# EAGLE schematic OSD62-PM-BRK (EAGLE 9.6.2)
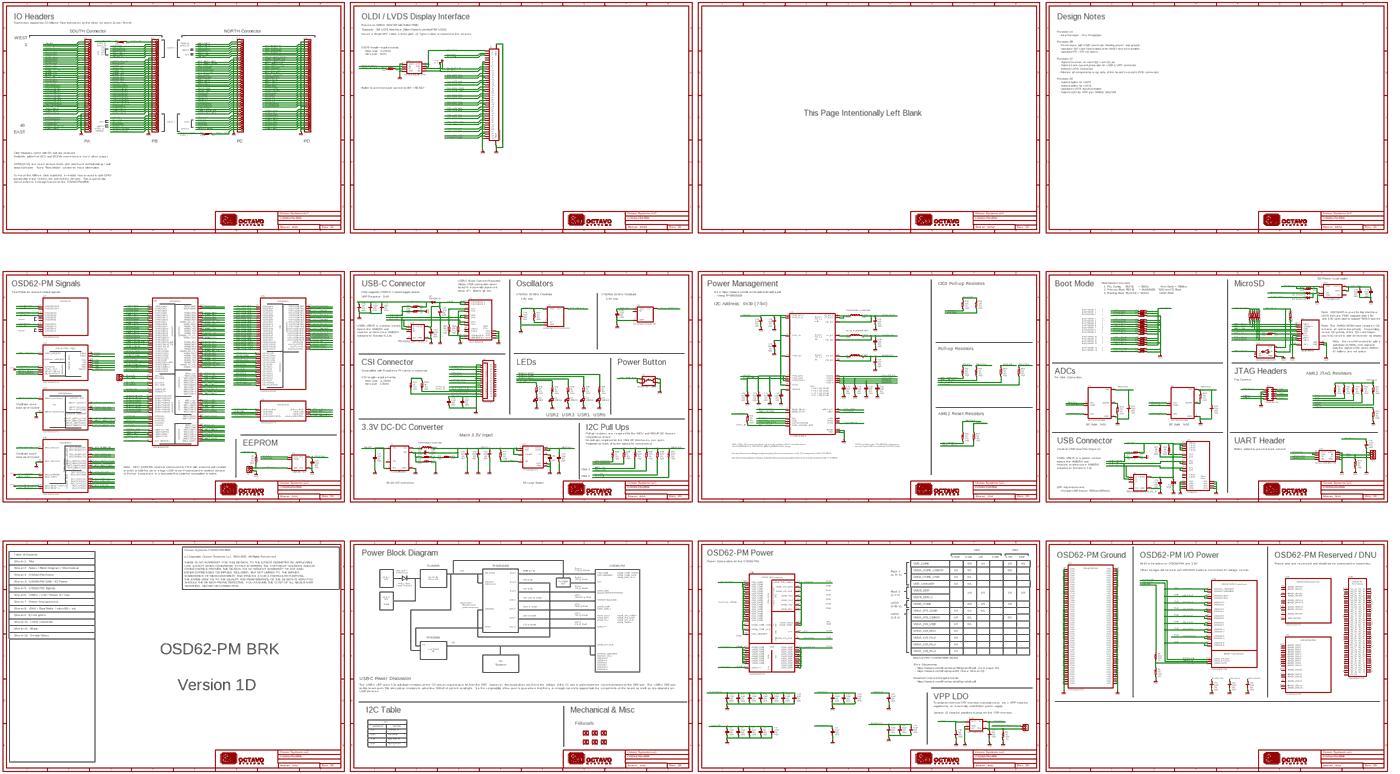
[diagram p0: schematic, sheet 1, overview]
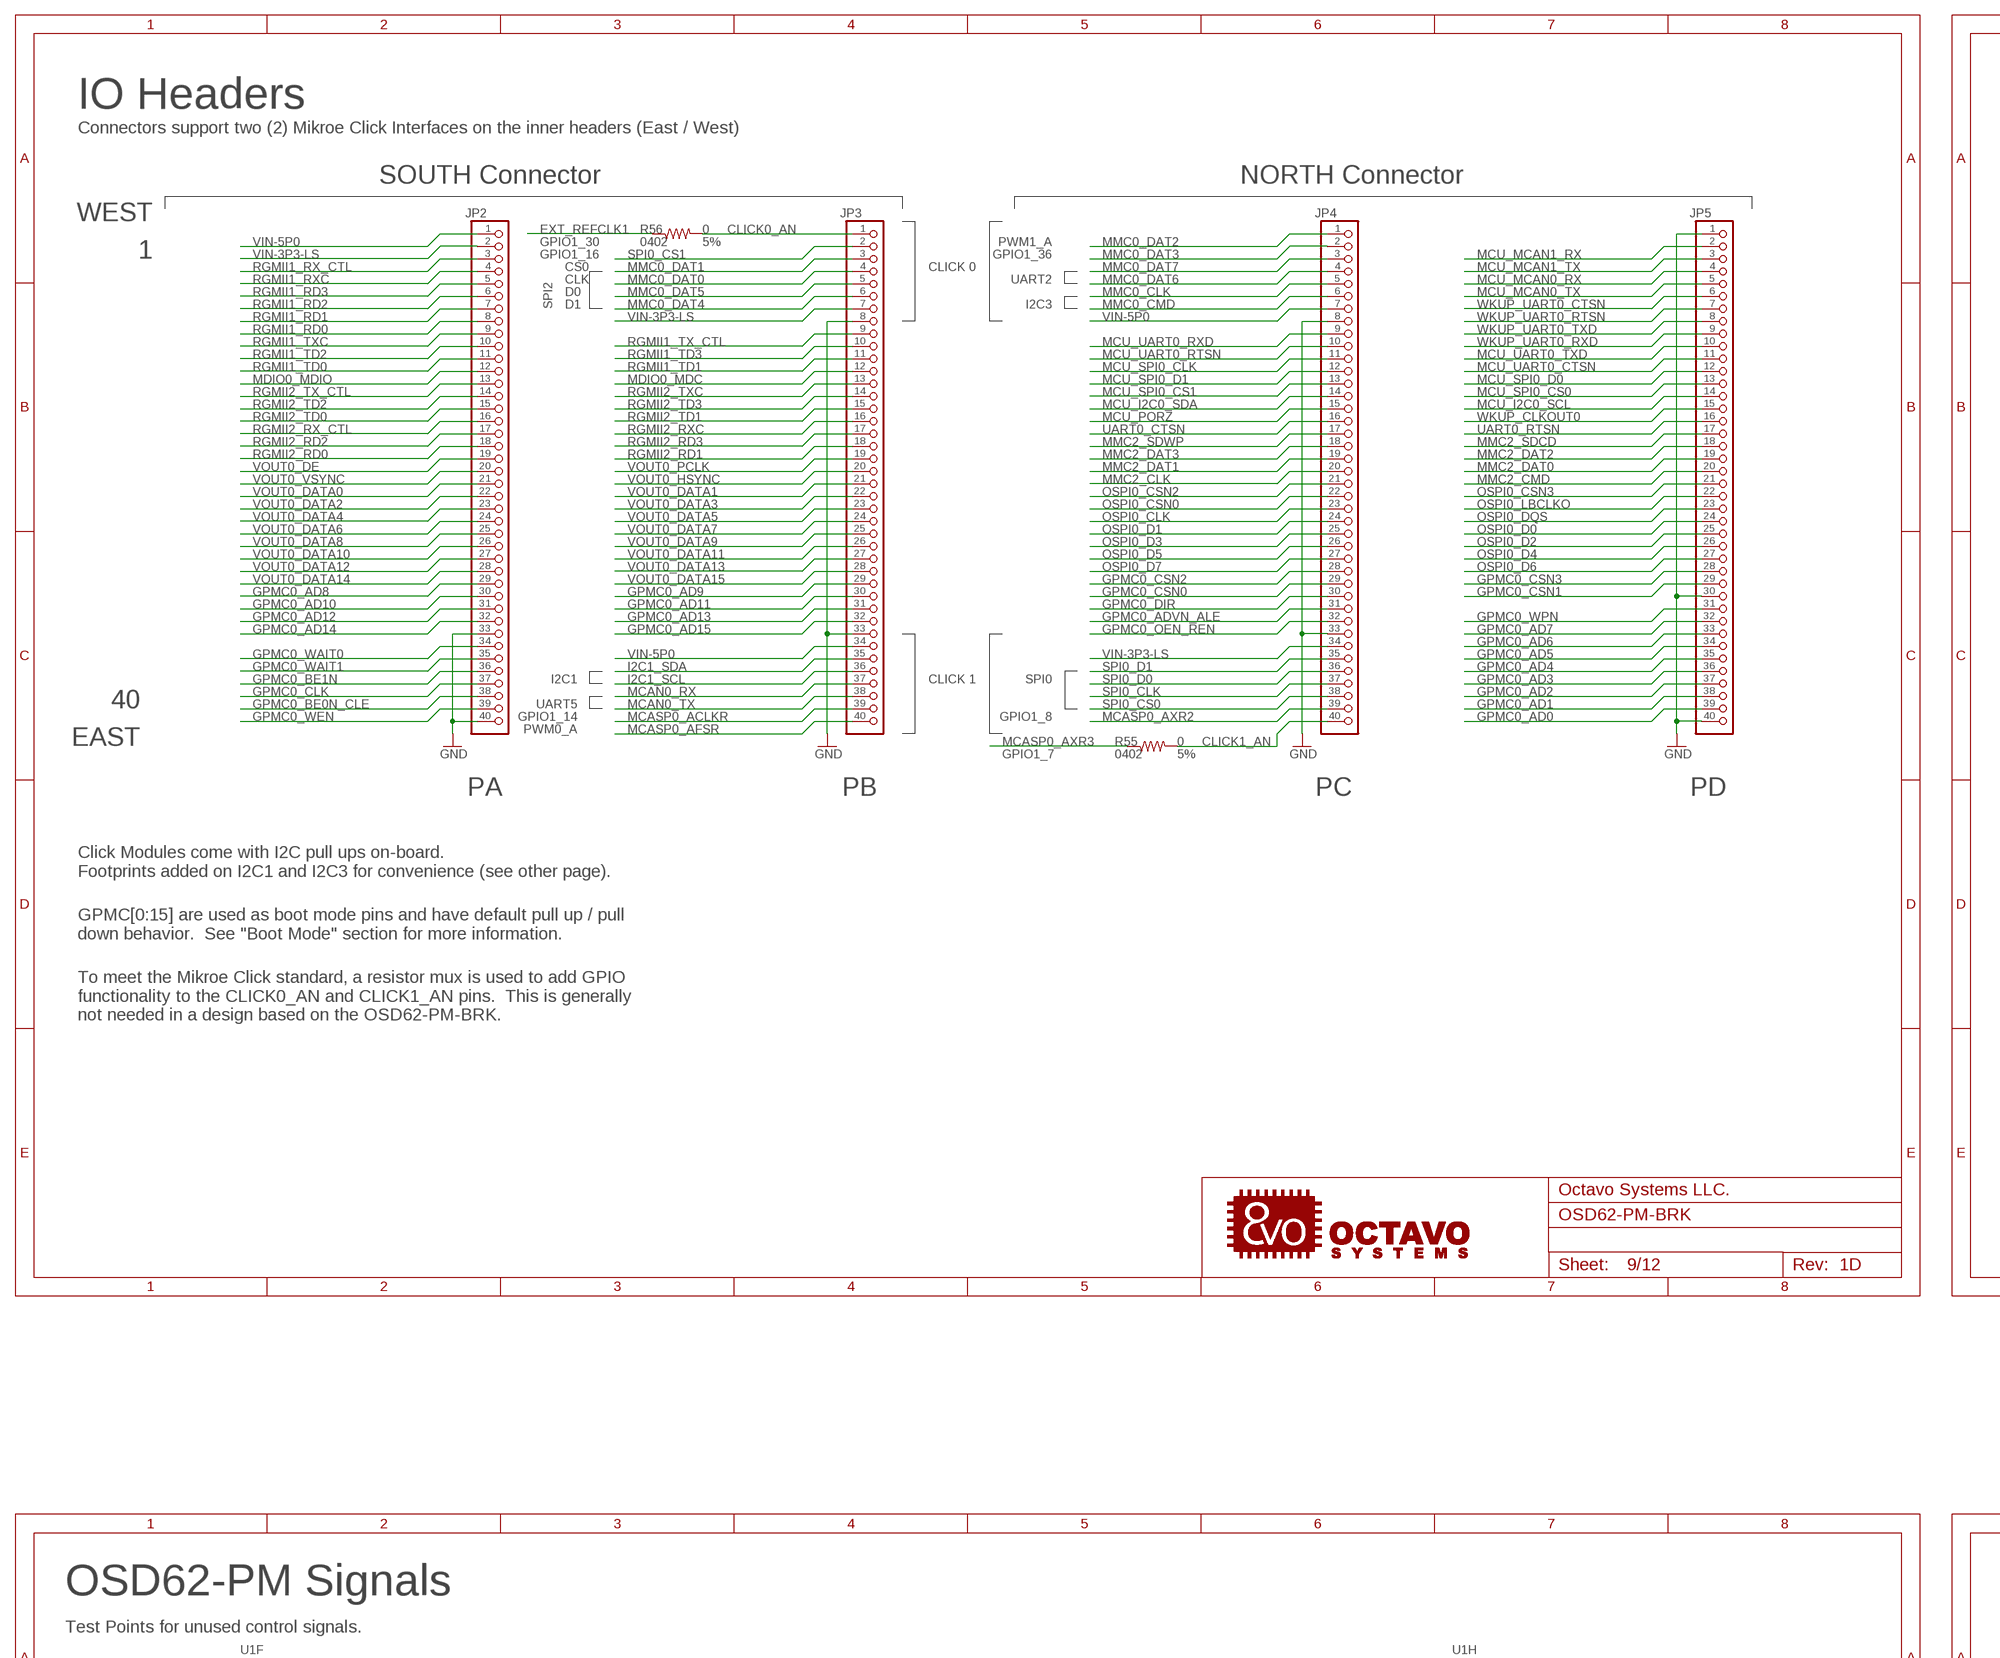
[diagram p1: schematic, sheet 1, part 1 of 8]
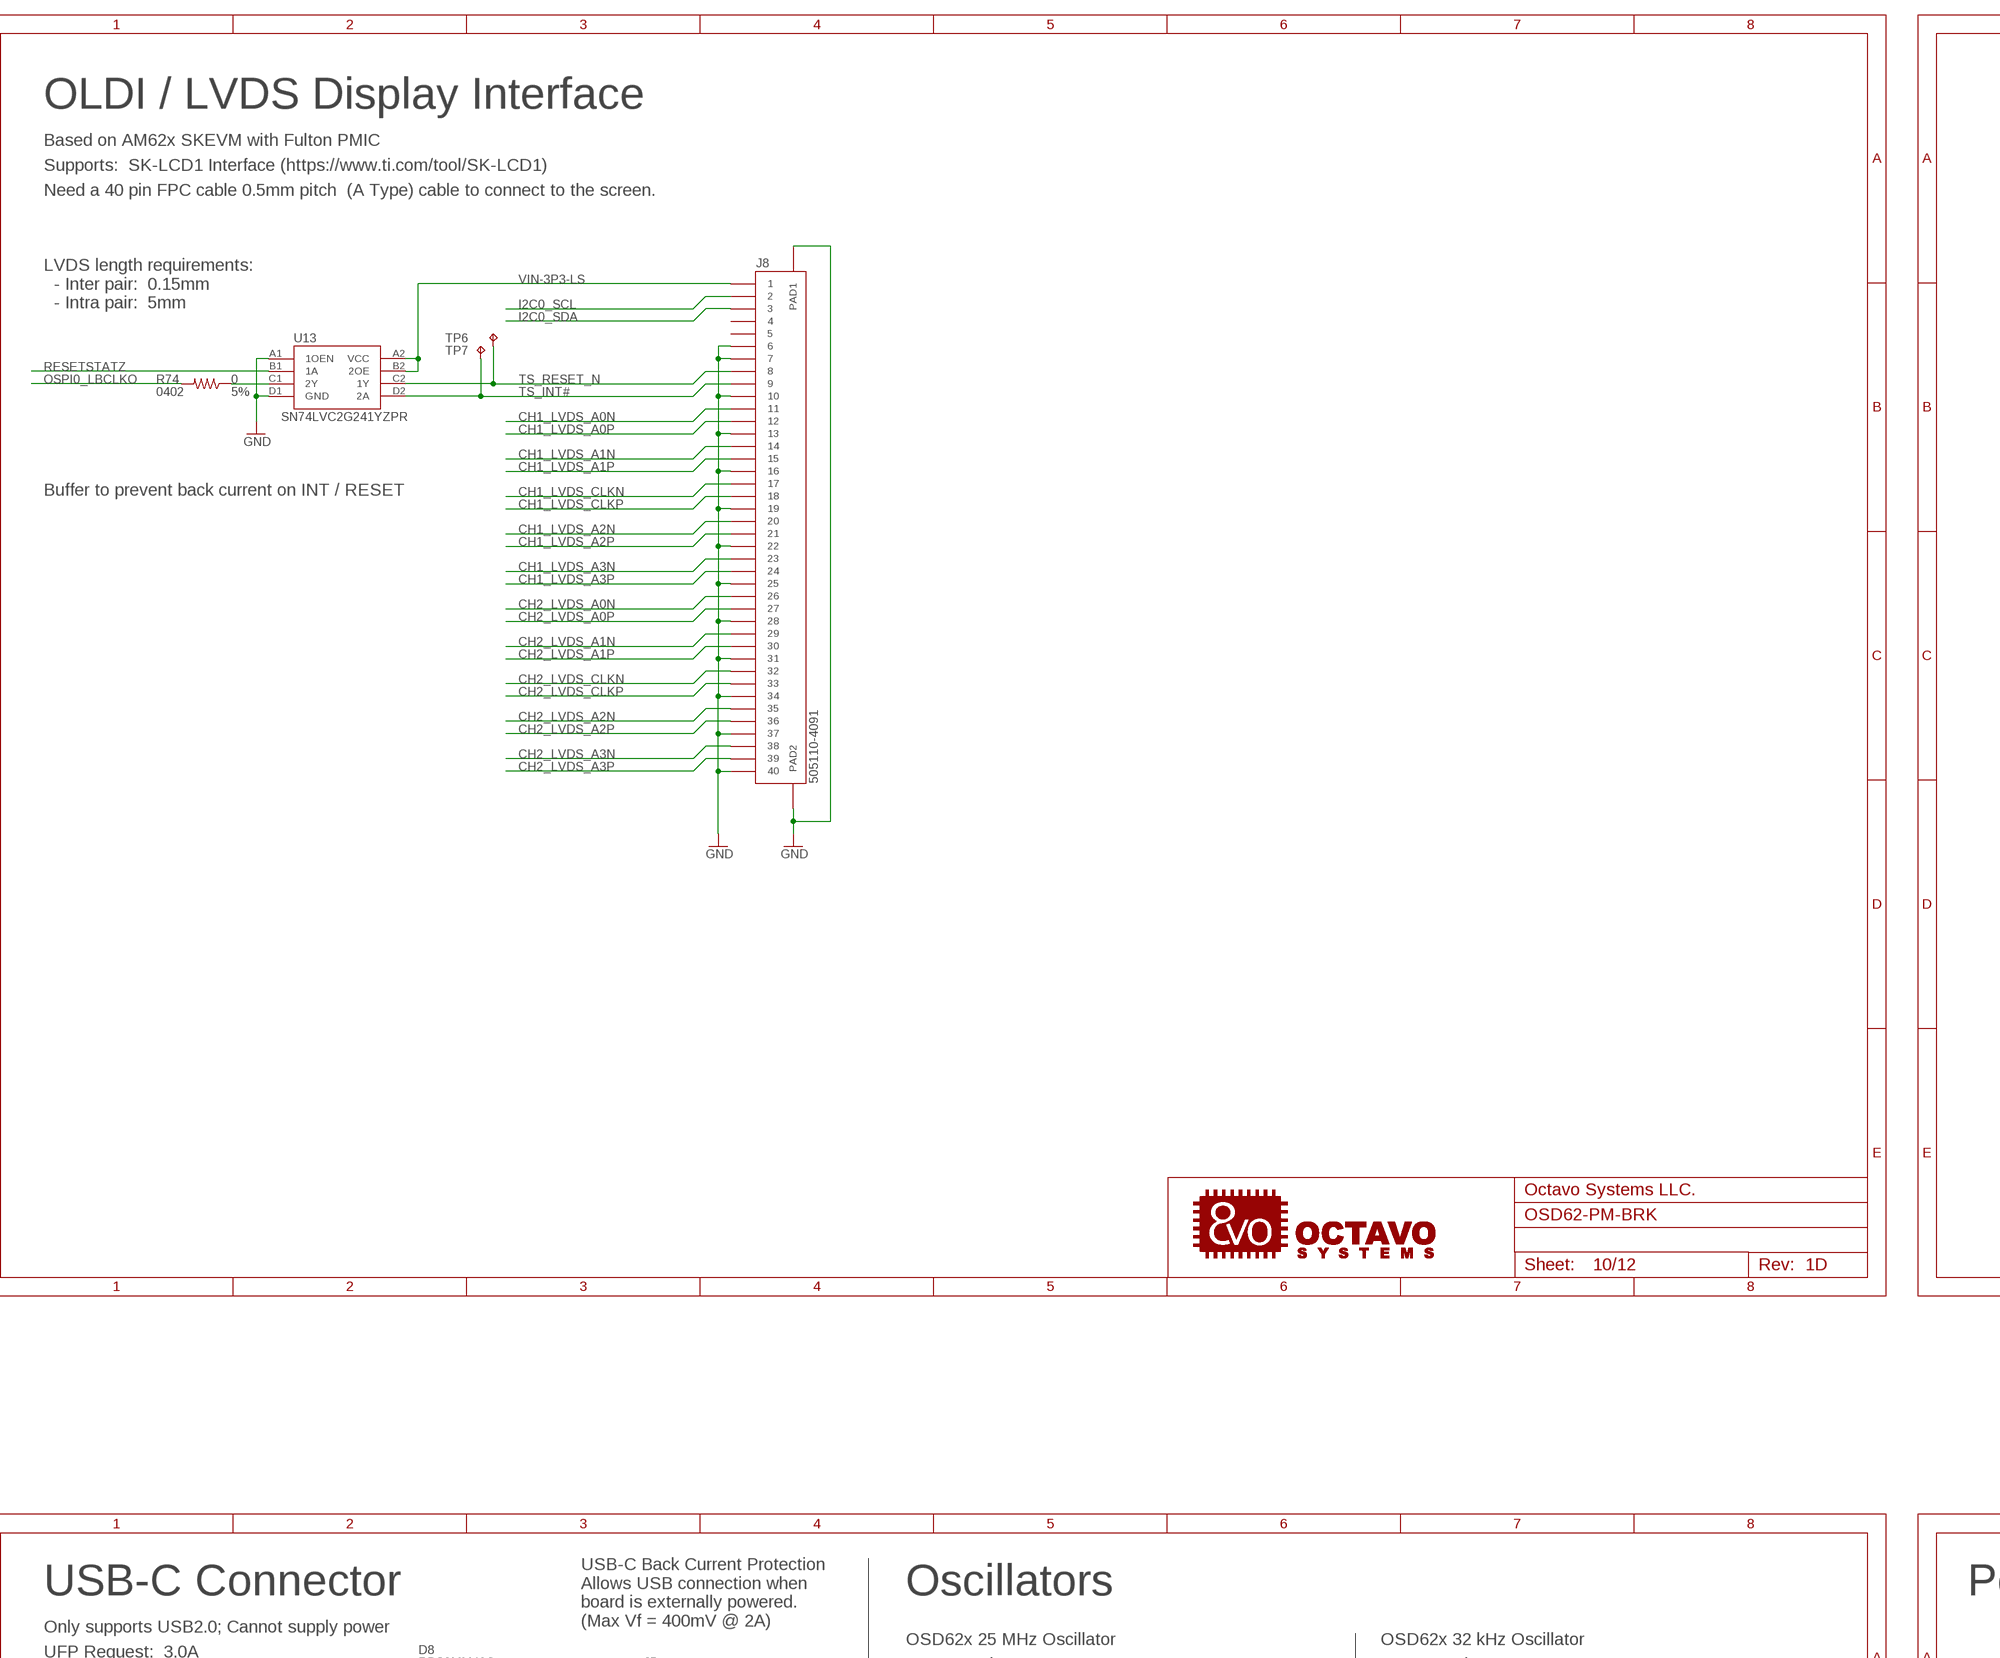
[diagram p2: schematic, sheet 1, part 2 of 8]
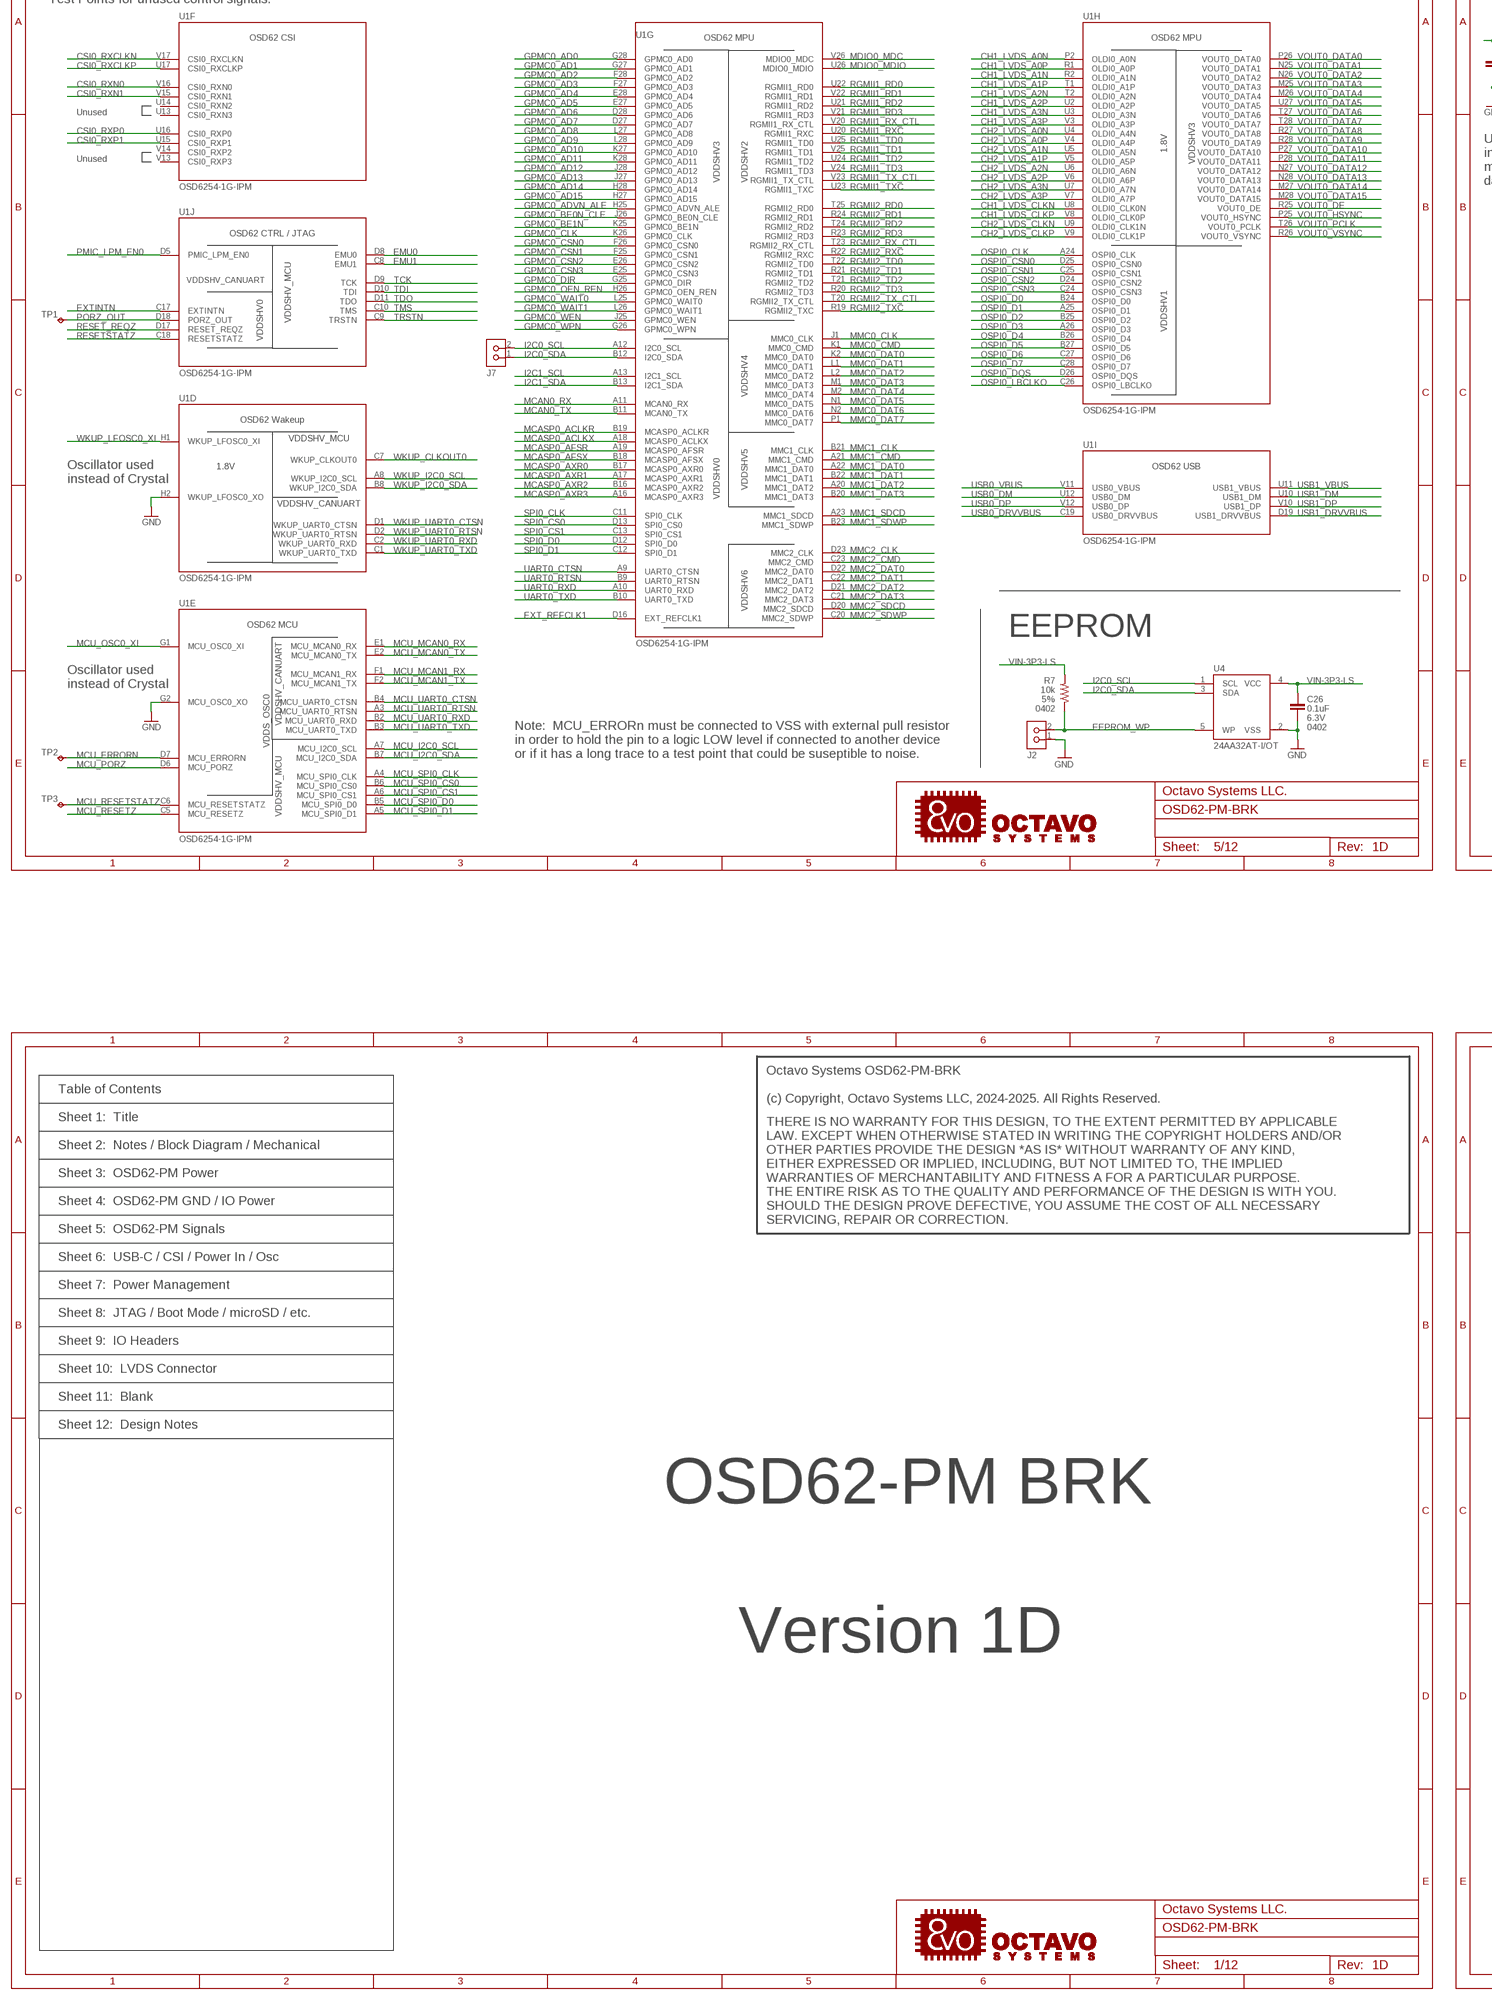
[diagram p3: schematic, sheet 1, part 3 of 8]
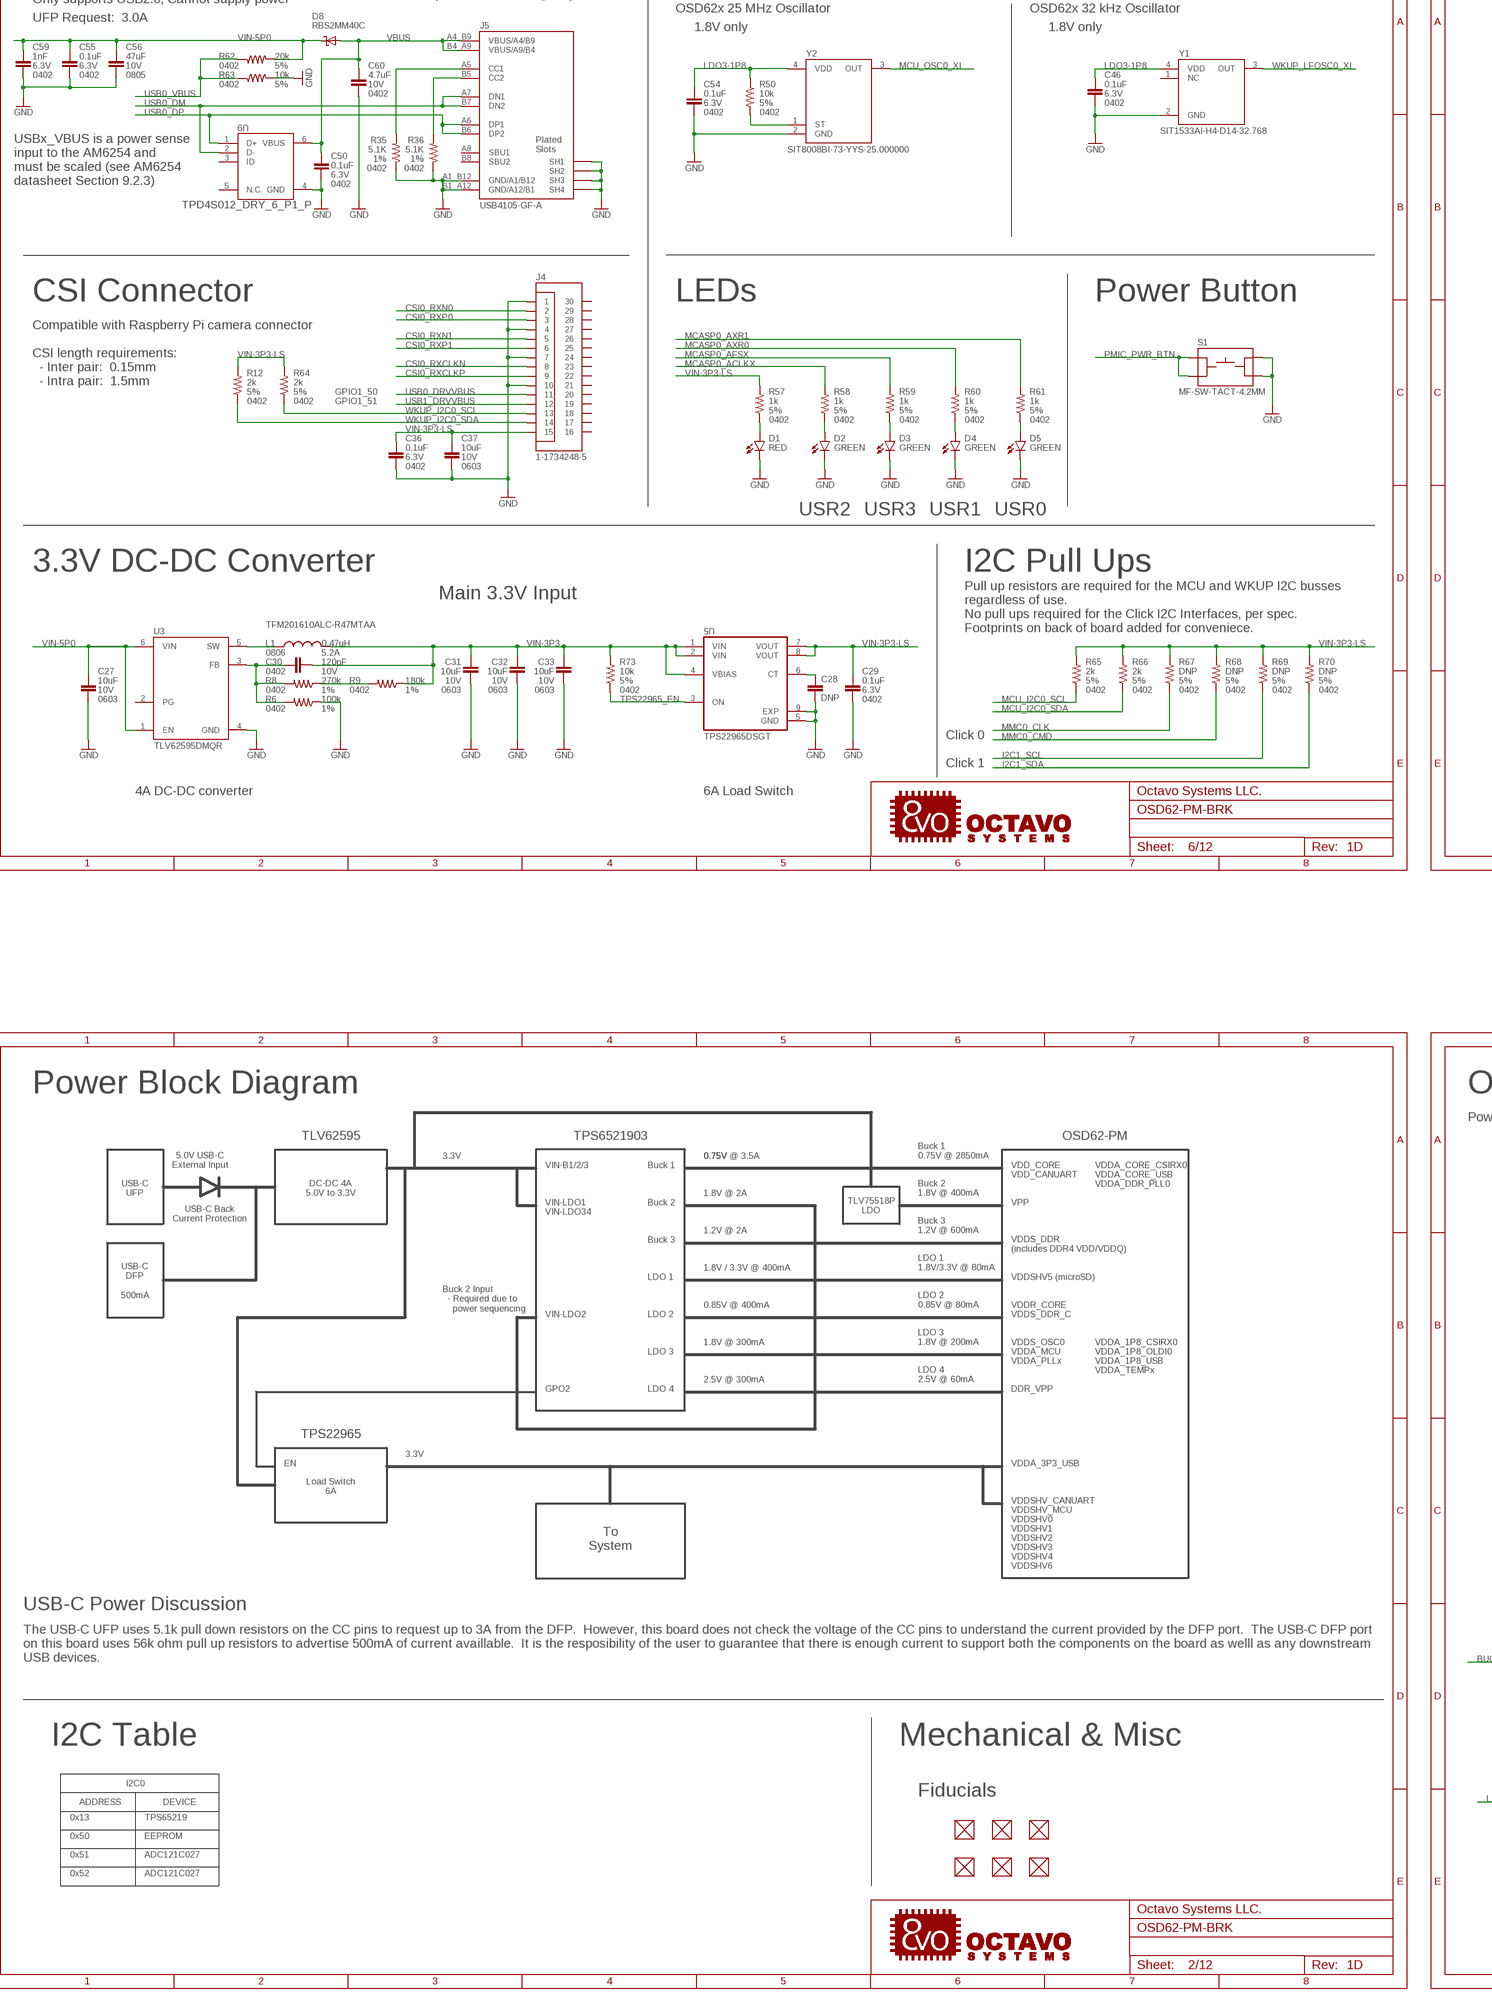
[diagram p4: schematic, sheet 1, part 4 of 8]
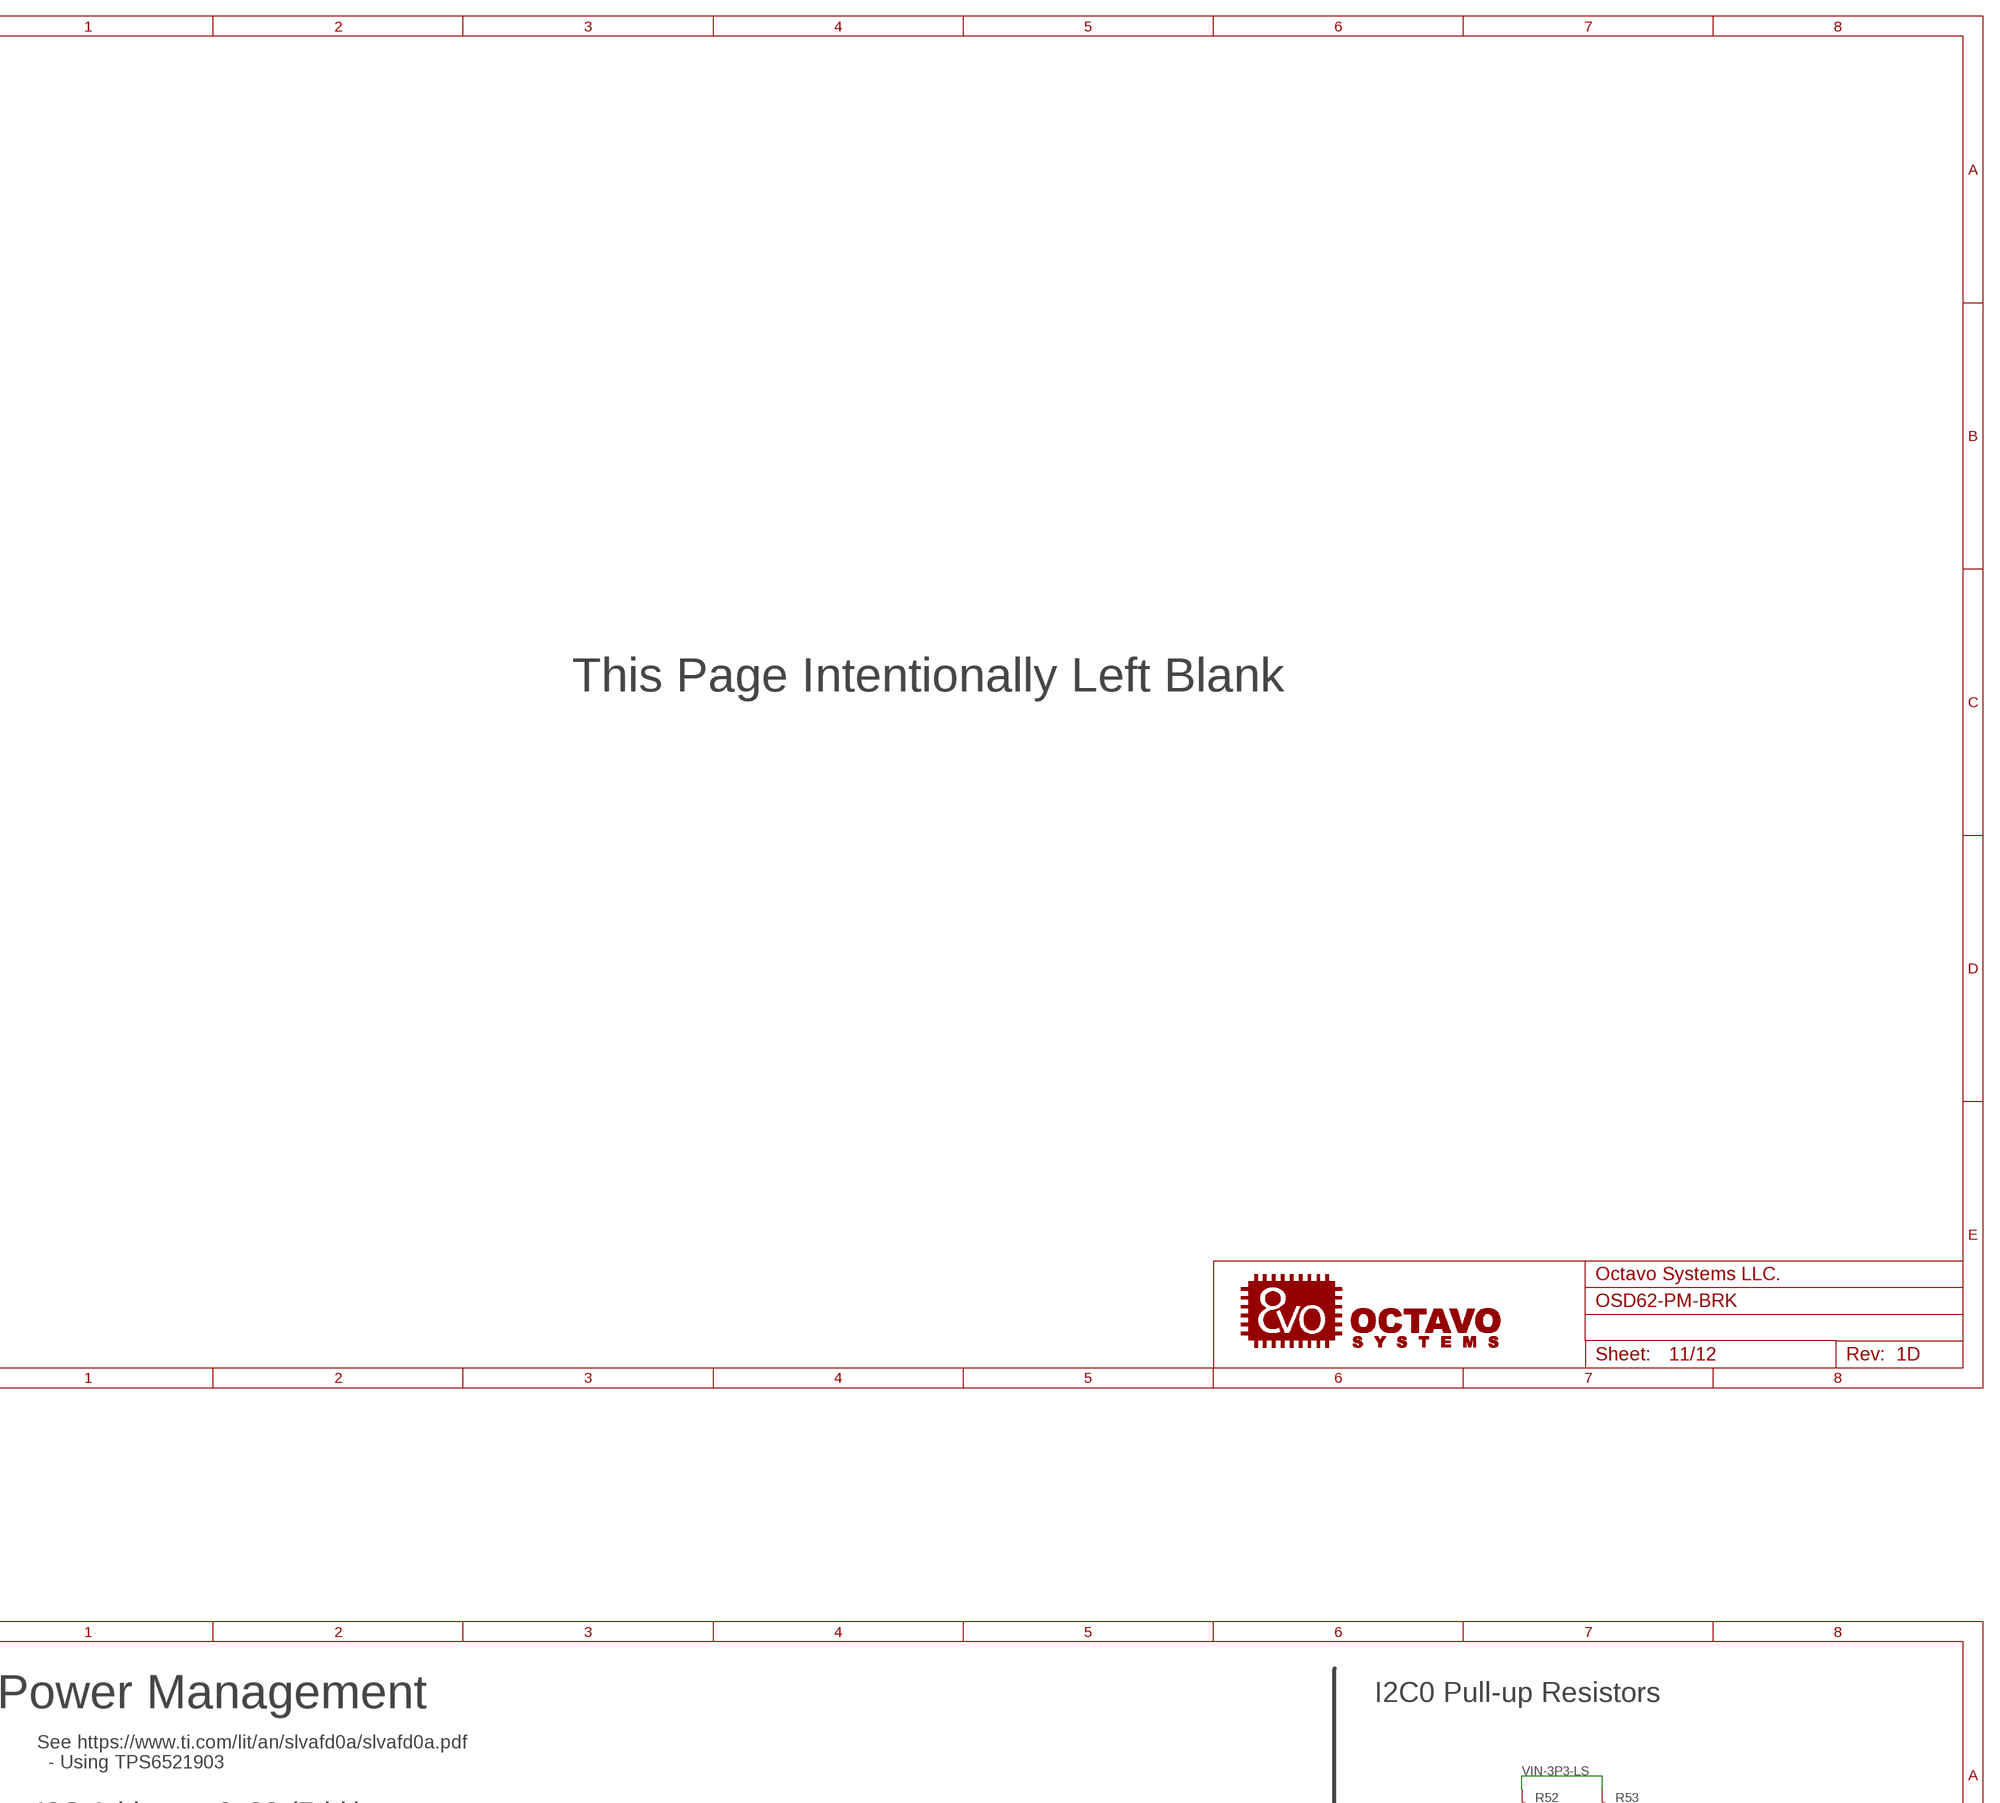
[diagram p5: schematic, sheet 1, part 5 of 8]
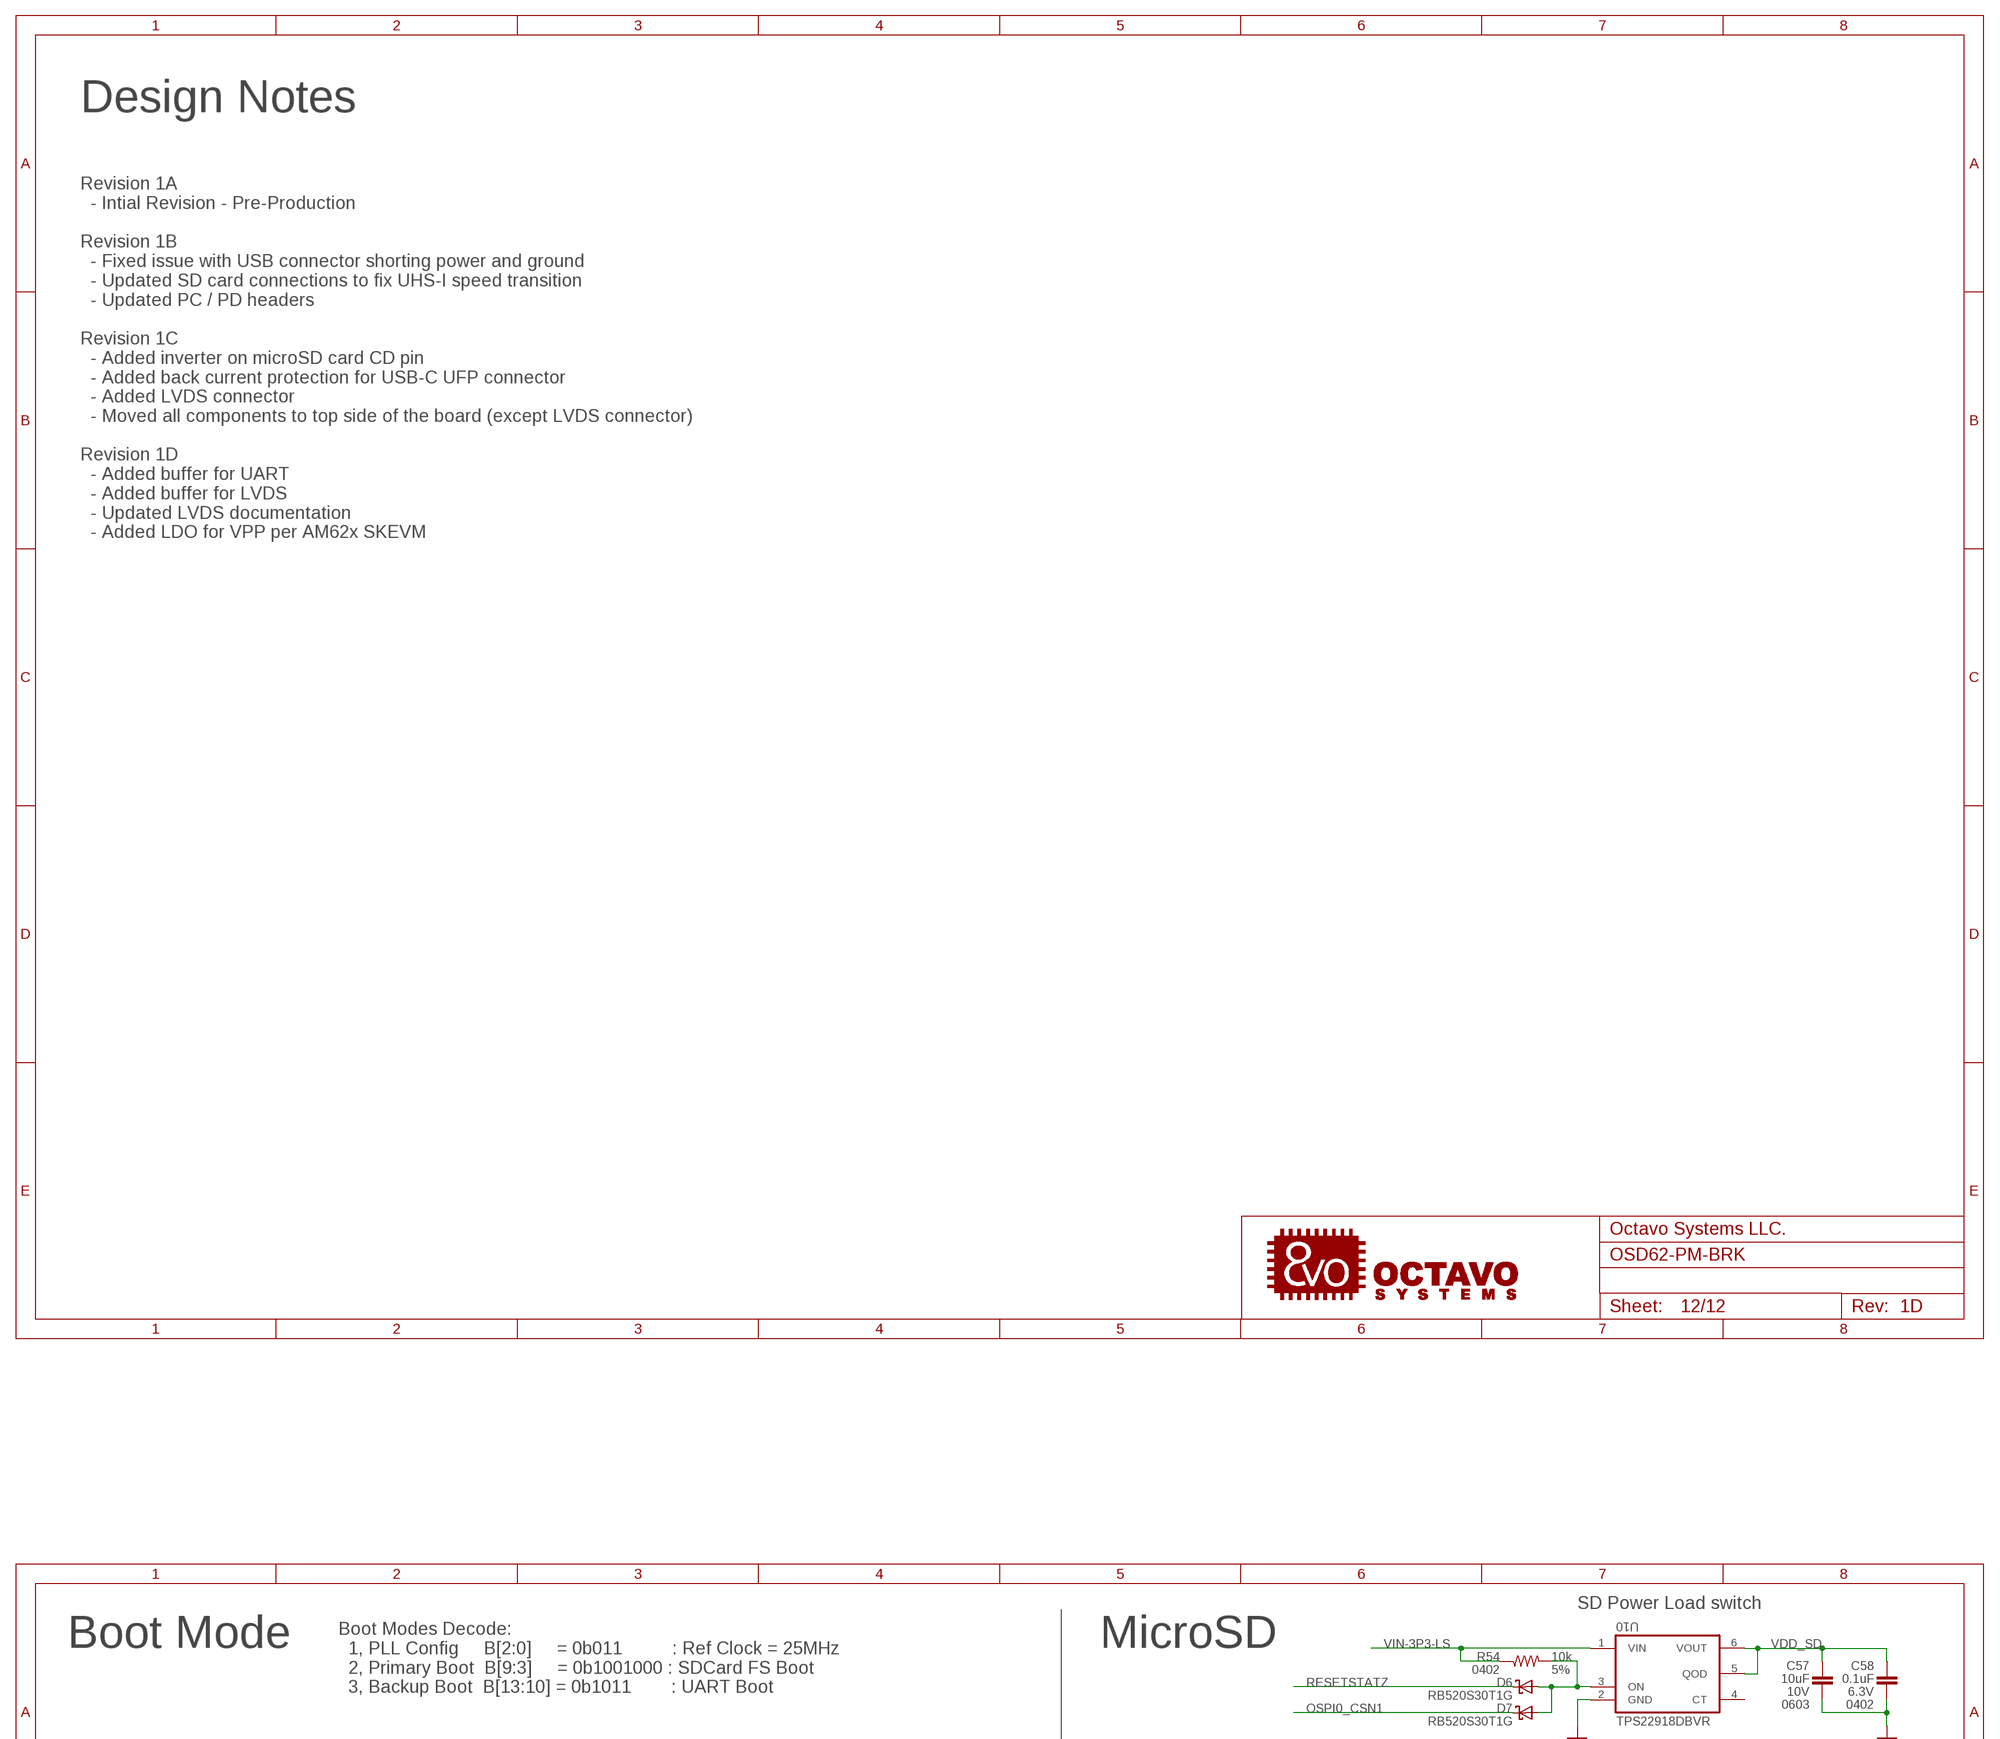
[diagram p6: schematic, sheet 1, part 6 of 8]
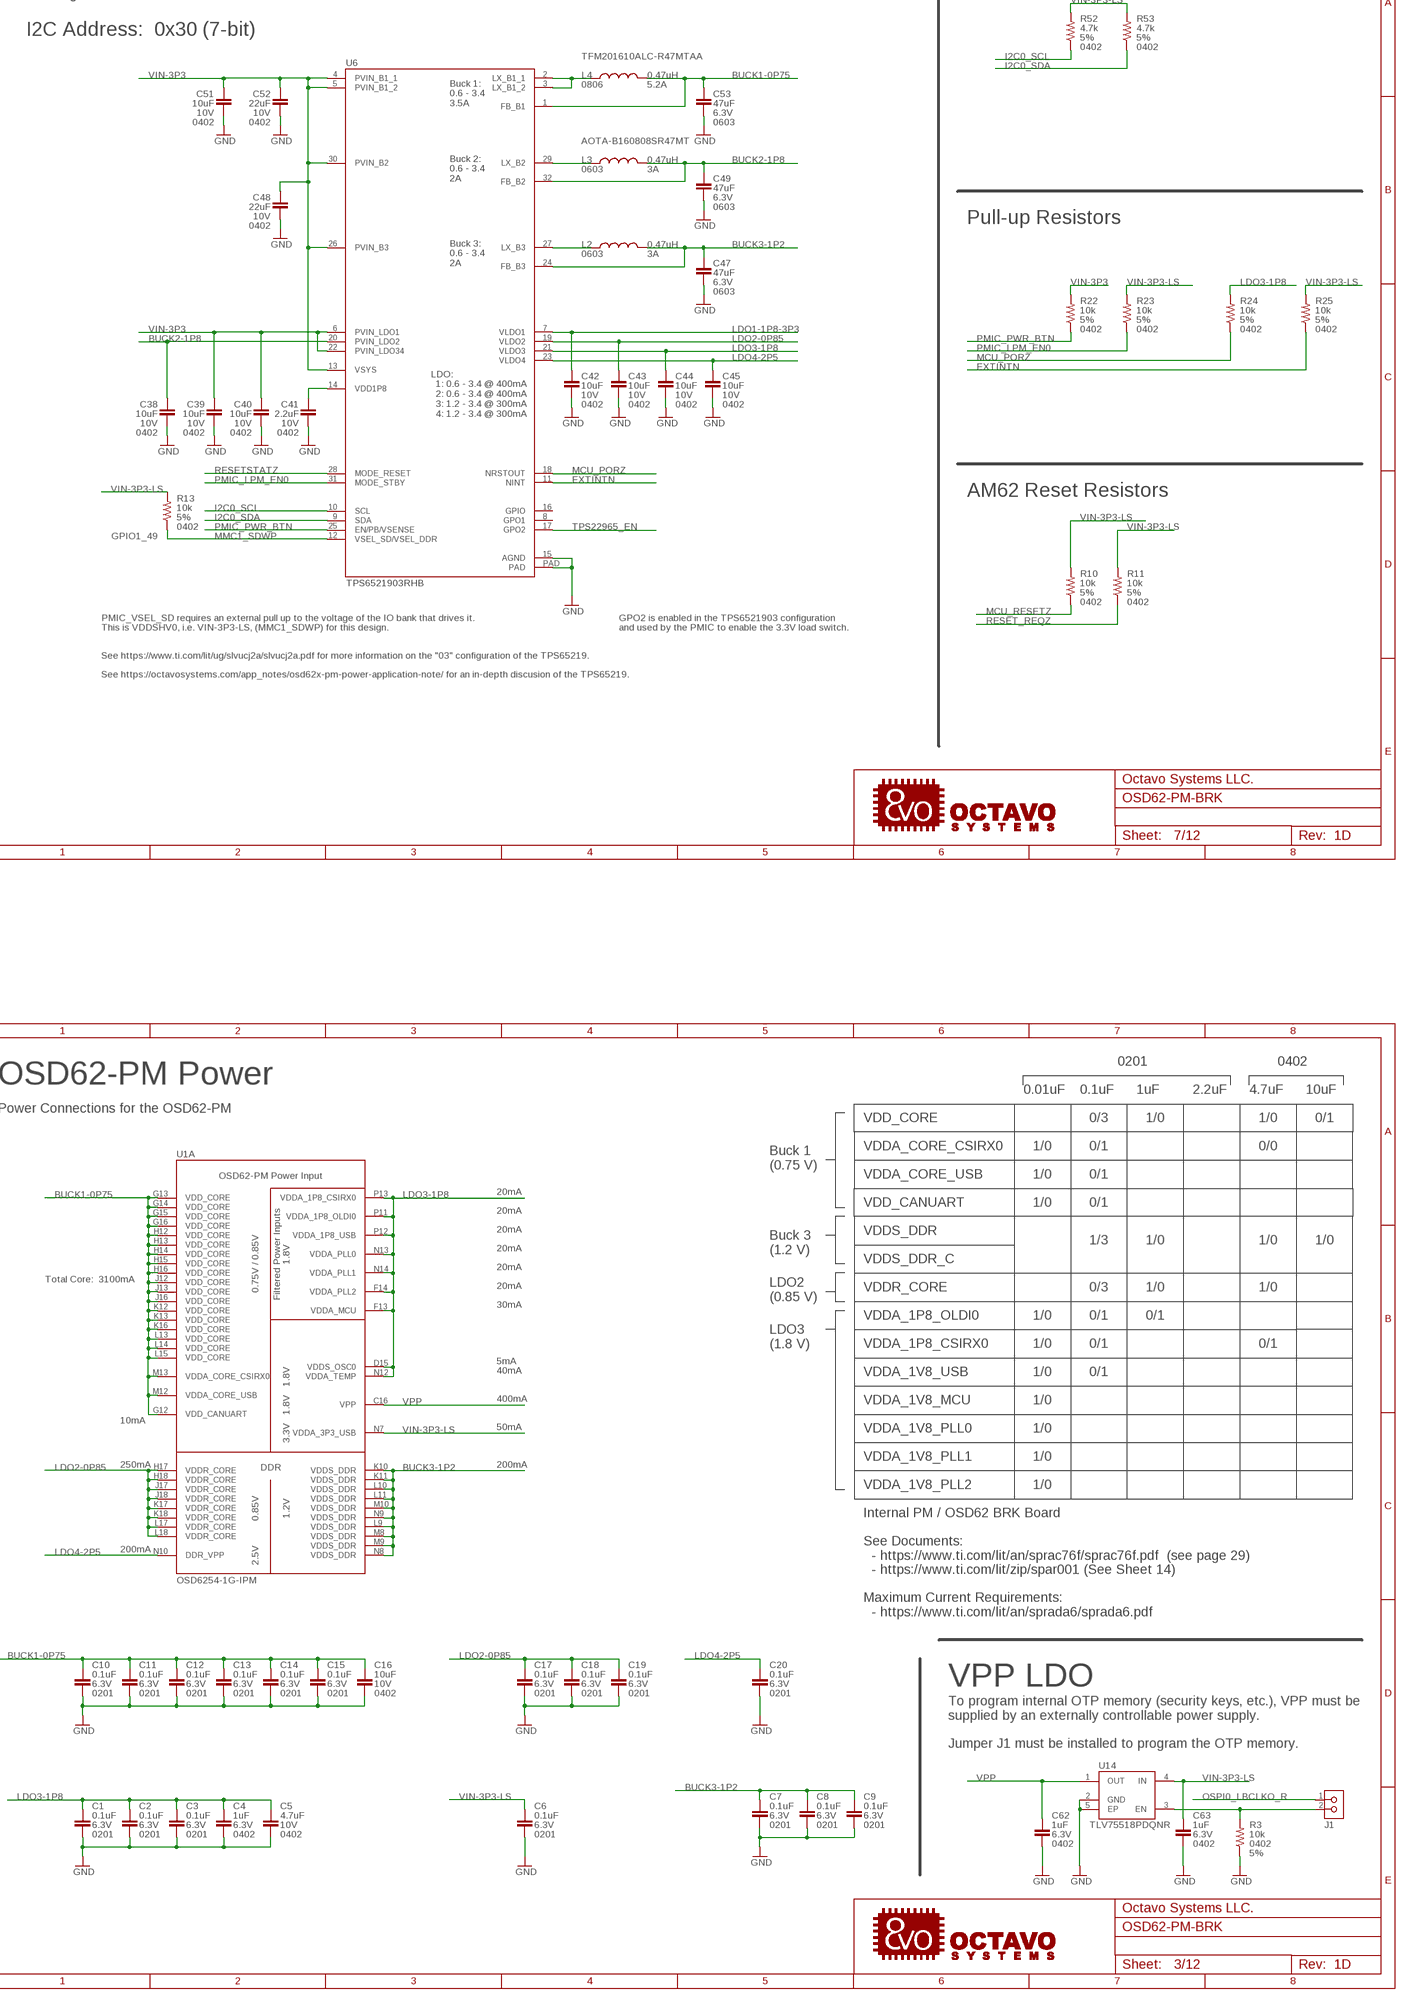
[diagram p7: schematic, sheet 1, part 7 of 8]
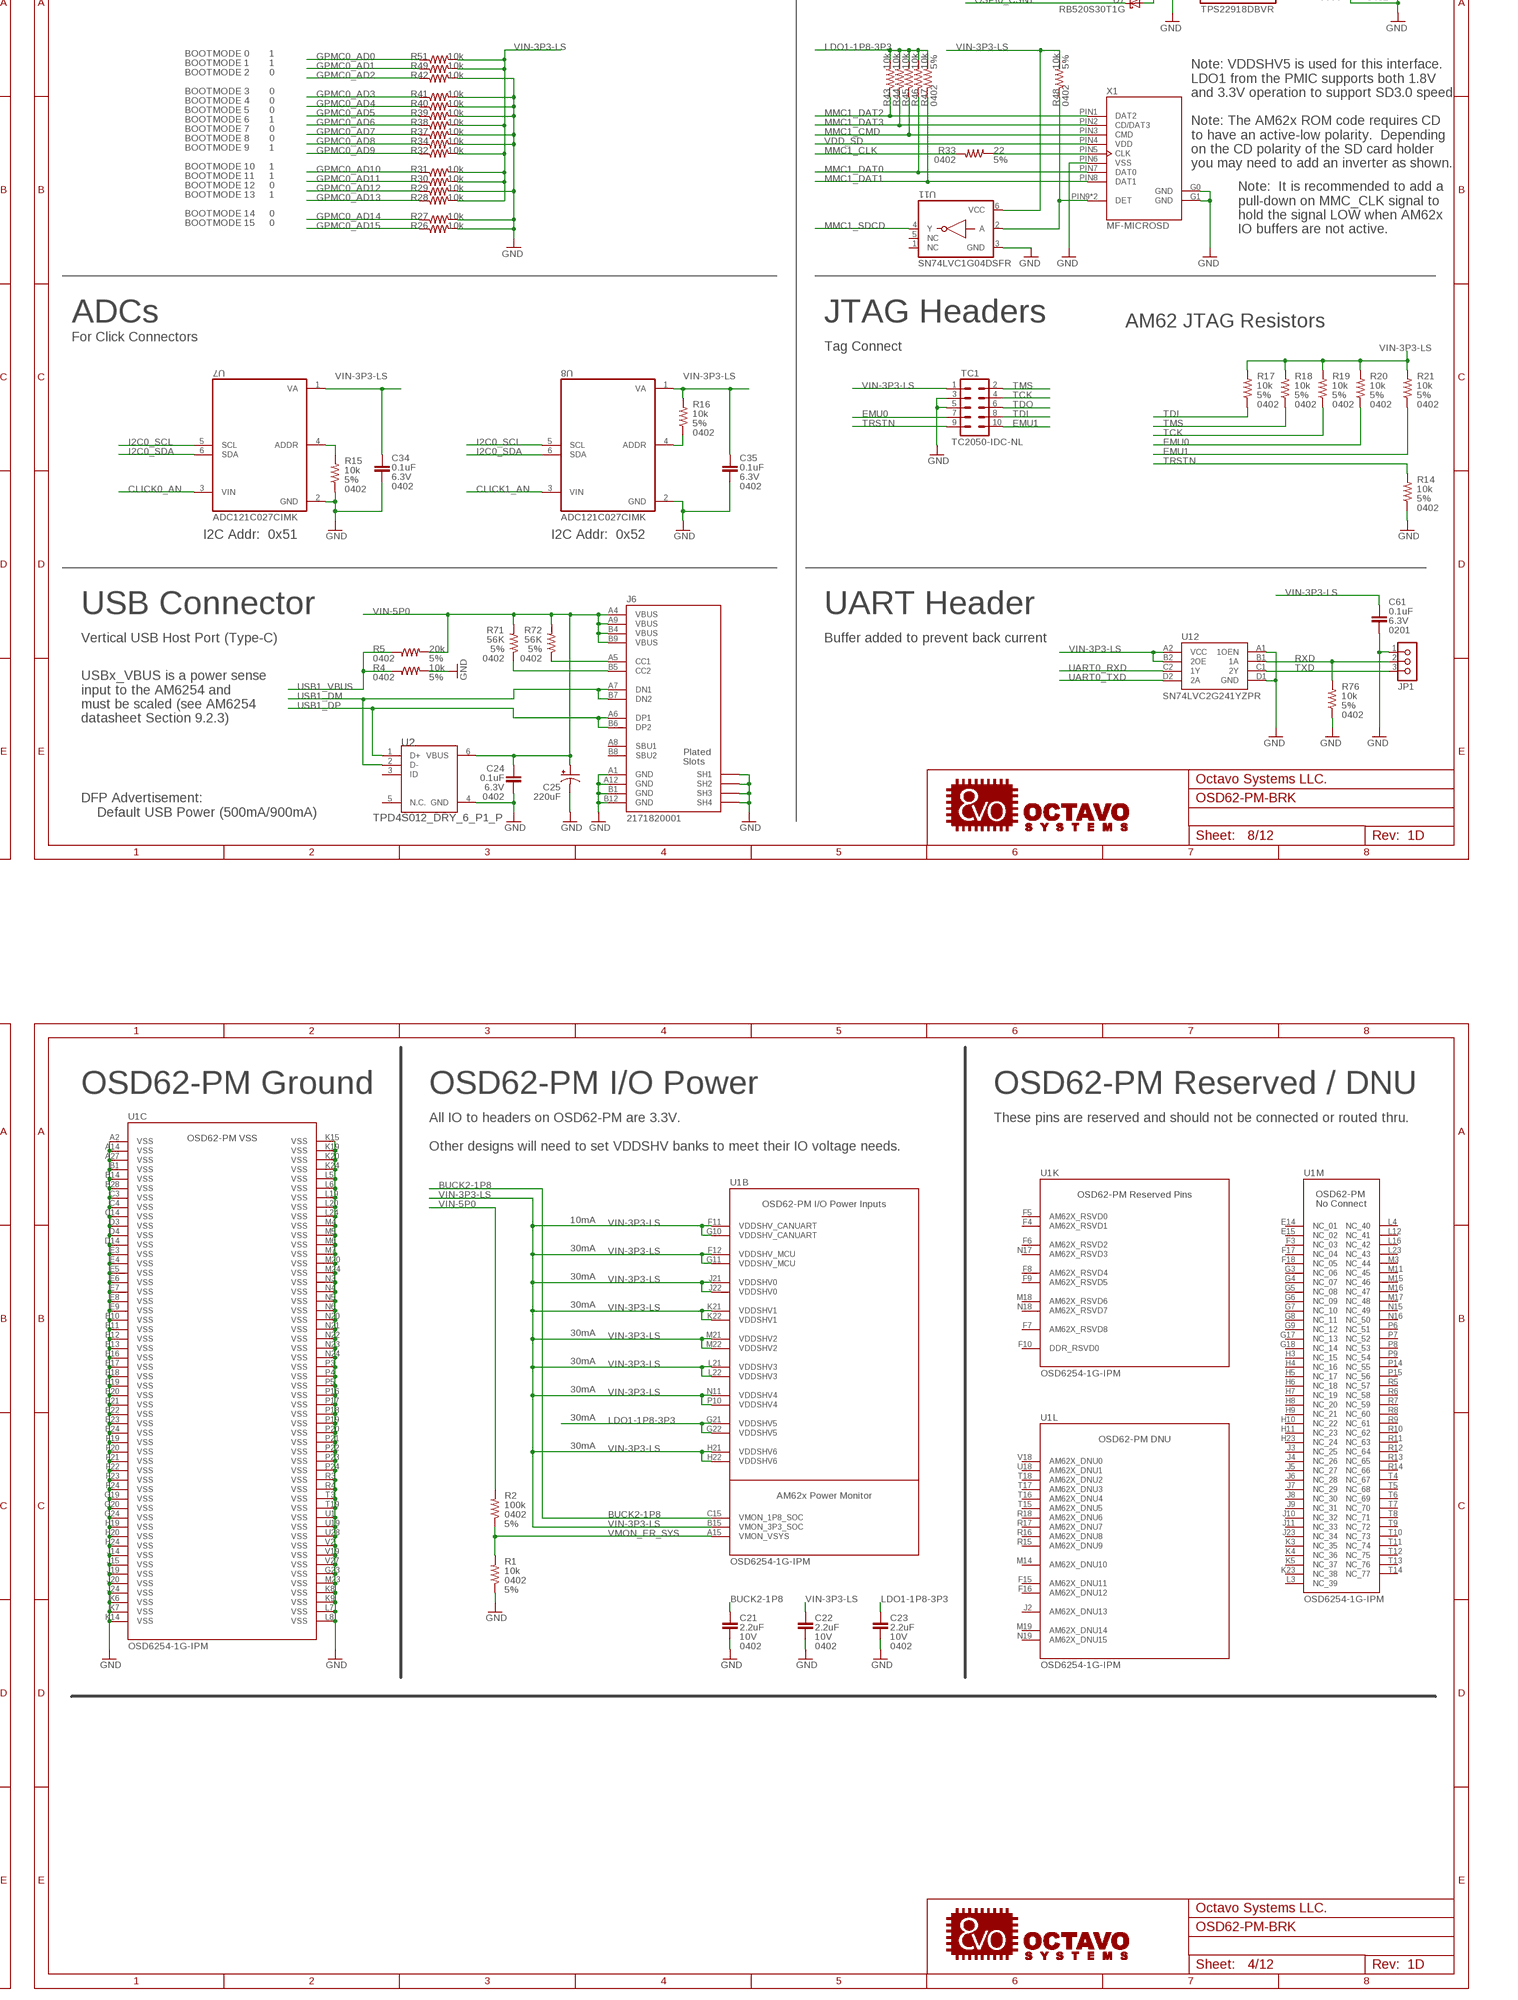
[diagram p8: schematic, sheet 1, part 8 of 8]

## Parts
C1  0.1uF  CC0201  [C0201]
C2  0.1uF  CC0201  [C0201]
C3  0.1uF  CC0201  [C0201]
C4  1uF  CC0402  [C0402]
C5  4.7uF  CC0402  [C0402]
C6  0.1uF  CC0201  [C0201]
C7  0.1uF  CC0201  [C0201]
C8  0.1uF  CC0201  [C0201]
C9  0.1uF  CC0201  [C0201]
C10  0.1uF  CC0201  [C0201]
C11  0.1uF  CC0201  [C0201]
C12  0.1uF  CC0201  [C0201]
C13  0.1uF  CC0201  [C0201]
C14  0.1uF  CC0201  [C0201]
C15  0.1uF  CC0201  [C0201]
C16  10uF  CC0402  [C0402]
C17  0.1uF  CC0201  [C0201]
C18  0.1uF  CC0201  [C0201]
C19  0.1uF  CC0201  [C0201]
C20  0.1uF  CC0201  [C0201]
C21  2.2uF  CC0402  [C0402]
C22  2.2uF  CC0402  [C0402]
C23  2.2uF  CC0402  [C0402]
C24  0.1uF  CC0402  [C0402]
C25  220uF  CPOL-USB/3528-21R  [B/3528-21R]
C26  0.1uF  CC0402  [C0402]
C27  10uF  CC0603  [C0603]
C28  DNP  CC0402  [C0402]
C29  0.1uF  CC0402  [C0402]
C30  120pF  CC0402  [C0402]
C31  10uF  CC0603  [C0603]
C32  10uF  CC0603  [C0603]
C33  10uF  CC0603  [C0603]
C34  0.1uF  CC0402  [C0402]
C35  0.1uF  CC0402  [C0402]
C36  0.1uF  CC0402  [C0402]
C37  10uF  CC0603  [C0603]
C38  10uF  CC0402  [C0402]
C39  10uF  CC0402  [C0402]
C40  10uF  CC0402  [C0402]
C41  2.2uF  CC0402  [C0402]
C42  10uF  CC0402  [C0402]
C43  10uF  CC0402  [C0402]
C44  10uF  CC0402  [C0402]
C45  10uF  CC0402  [C0402]
C46  0.1uF  CC0402  [C0402]
C47  47uF  CC0603  [C0603]
C48  22uF  CC0402  [C0402]
C49  47uF  CC0603  [C0603]
C50  0.1uF  CC0402  [C0402]
C51  10uF  CC0402  [C0402]
C52  22uF  CC0402  [C0402]
C53  47uF  CC0603  [C0603]
C54  0.1uF  CC0402  [C0402]
C55  0.1uF  CC0402  [C0402]
C56  47uF  CC0805  [C0805]
C57  10uF  CC0603  [C0603]
C58  0.1uF  CC0402  [C0402]
C59  1nF  CC0402  [C0402]
C60  4.7uF  CC0402  [C0402]
C61  0.1uF  CC0201  [C0201]
C62  1uF  CC0402  [C0402]
C63  1uF  CC0402  [C0402]
D1  RED  LTST-C191TBKTLALED_EIA-STD  [EIA-STD]
D2  GREEN  LTST-C191TBKTLALED_EIA-STD  [EIA-STD]
D3  GREEN  LTST-C191TBKTLALED_EIA-STD  [EIA-STD]
D4  GREEN  LTST-C191TBKTLALED_EIA-STD  [EIA-STD]
D5  GREEN  LTST-C191TBKTLALED_EIA-STD  [EIA-STD]
D6  RB520S30T1G  [RB520S30T1G]
D7  RB520S30T1G  [RB520S30T1G]
D8  RBS2MM40C  [SOD-123FL]
FUD1  FIDUCIAL  [FIDUCIAL_40MIL]
FUD2  FIDUCIAL  [FIDUCIAL_40MIL]
FUD3  FIDUCIAL  [FIDUCIAL_40MIL]
FUD4  FIDUCIAL  [FIDUCIAL_40MIL]
FUD5  FIDUCIAL  [FIDUCIAL_40MIL]
FUD6  FIDUCIAL  [FIDUCIAL_40MIL]
J1  PINHD-1X21.27  [H1X2-1.27]
J2  PINHD-1X2  [H1X2-2.54]
J4  1-1734248-5  [TE_1-1734248-5]
J5  USB4105-GF-A  [GCT_USB4105-GF-A]
J6  2171820001  [MOLEX_2171820001]
J7  PINHD-1X2  [H1X2-2.54]
J8  505110-4091  [MOLEX_505110-4091]
JP1  PINHD-1X3  [H1X3-2.54]
JP2  PINHD-1X40  [H1X40-2.54]
JP3  PINHD-1X40  [H1X40-2.54]
JP4  PINHD-1X40  [H1X40-2.54]
JP5  PINHD-1X40  [H1X40-2.54]
L1  0.47uH  L0806  [L0806]
L2  0.47uH  L0603  [L0603]
L3  0.47uH  L0603  [L0603]
L4  0.47uH  L0806  [L0806]
R1  10k  R-US_R0402  [R0402]
R2  100k  R-US_R0402  [R0402]
R3  10k  R-US_R0402  [R0402]
R4  10k  R-US_R0402  [R0402]
R5  20k  R-US_R0402  [R0402]
R6  100k  R-US_R0402  [R0402]
R7  10k  R-US_R0402  [R0402]
R8  270k  R-US_R0402  [R0402]
R9  180k  R-US_R0402  [R0402]
R10  10k  R-US_R0402  [R0402]
R11  10k  R-US_R0402  [R0402]
R12  2k  R-US_R0402  [R0402]
R13  10k  R-US_R0402  [R0402]
R14  10k  R-US_R0402  [R0402]
R15  10k  R-US_R0402  [R0402]
R16  10k  R-US_R0402  [R0402]
R17  10k  R-US_R0402  [R0402]
R18  10k  R-US_R0402  [R0402]
R19  10k  R-US_R0402  [R0402]
R20  10k  R-US_R0402  [R0402]
R21  10k  R-US_R0402  [R0402]
R22  10k  R-US_R0402  [R0402]
R23  10k  R-US_R0402  [R0402]
R24  10k  R-US_R0402  [R0402]
R25  10k  R-US_R0402  [R0402]
R26  10k  R-US_R0402  [R0402]
R27  10k  R-US_R0402  [R0402]
R28  10k  R-US_R0402  [R0402]
R29  10k  R-US_R0402  [R0402]
R30  10k  R-US_R0402  [R0402]
R31  10k  R-US_R0402  [R0402]
R32  10k  R-US_R0402  [R0402]
R33  22  R-US_R0402  [R0402]
R34  10k  R-US_R0402  [R0402]
R35  5.1K  R-US_R0402  [R0402]
R36  5.1K  R-US_R0402  [R0402]
R37  10k  R-US_R0402  [R0402]
R38  10k  R-US_R0402  [R0402]
R39  10k  R-US_R0402  [R0402]
R40  10k  R-US_R0402  [R0402]
R41  10k  R-US_R0402  [R0402]
R42  10k  R-US_R0402  [R0402]
R43  10k  R-US_R0402  [R0402]
R44  10k  R-US_R0402  [R0402]
R45  10k  R-US_R0402  [R0402]
R46  10k  R-US_R0402  [R0402]
R47  10k  R-US_R0402  [R0402]
R48  10k  R-US_R0402  [R0402]
R49  10k  R-US_R0402  [R0402]
R50  10k  R-US_R0402  [R0402]
R51  10k  R-US_R0402  [R0402]
R52  4.7k  R-US_R0402  [R0402]
R53  4.7k  R-US_R0402  [R0402]
R54  10k  R-US_R0402  [R0402]
R55  0  R-US_R0402  [R0402]
R56  0  R-US_R0402  [R0402]
R57  1k  R-US_R0402  [R0402]
R58  1k  R-US_R0402  [R0402]
R59  1k  R-US_R0402  [R0402]
R60  1k  R-US_R0402  [R0402]
R61  1k  R-US_R0402  [R0402]
R62  20k  R-US_R0402  [R0402]
R63  10k  R-US_R0402  [R0402]
R64  2k  R-US_R0402  [R0402]
R65  2k  R-US_R0402  [R0402]
R66  2k  R-US_R0402  [R0402]
R67  DNP  R-US_R0402  [R0402]
R68  DNP  R-US_R0402  [R0402]
R69  DNP  R-US_R0402  [R0402]
R70  DNP  R-US_R0402  [R0402]
R71  56K  R-US_R0402  [R0402]
R72  56K  R-US_R0402  [R0402]
R73  10k  R-US_R0402  [R0402]
R74  0  R-US_R0402  [R0402]
R76  10k  R-US_R0402  [R0402]
S1  MF-SW-TACT-4.2MM  TACT_4.2MM  [TACT4.2MM]
TC1  TC2050-IDC-NL  [TC2050-IDC-NL]
TP1  TPB0,65  [TP_B0,65]
TP2  TPB0,65  [TP_B0,65]
TP3  TPB0,65  [TP_B0,65]
TP6  TPB0,65  [TP_B0,65]
TP7  TPB0,65  [TP_B0,65]
U1  OSD6254-1G-IPM  [OSD6254-BGA-500]
U2  TPD4S012_DRY_6_P1_P  [DRY6]
U3  TLV62595DMQR  [DMQ0006A]
U4  24AA32AT-I/OT  [SOT95P280X145-5N]
U5  TPS22965DSGT  [SON50P200X200X80-9N]
U6  TPS6521903RHB  TPS65219-5X5  [RHB0032W]
U7  ADC121C027CIMK  [SOT95P280X110-6N]
U8  ADC121C027CIMK  [SOT95P280X110-6N]
U9  TPD4S012_DRY_6_P1_P  [DRY6]
U10  TPS22918DBVR  [SOT95P280X145-6N]
U11  SN74LVC1G04DSFR  [SON35P100X100X40-6N]
U12  SN74LVC2G241YZPR  [YZP0008]
U13  SN74LVC2G241YZPR  [YZP0008]
U14  TLV75518PDQNR  [DQN0004A]
X1  MF-MICROSD  SD_CARD_SLOT_MICRO_RIGHT  [MF-MICROSD]
Y1  SIT1533AI-H4-D14-32.768  [SIT1533AI_2X1.2MM]
Y2  SIT8008BI-73-YYS-25.000000  [QFN-4-2X1.6MM]

## Nets
3V3_FB: C30.1 R6.2 R8.2 U3.3(FB)
3V3_FB_0: R8.1 R9.2
3V3_SW: L1.1 U3.5(SW)
ADC0_ADDR: R15.2 U7.4(ADDR)
ADC1_ADDR: R16.1 U8.4(ADDR)
BUCK1-0P75: C10.1 C11.1 C12.1 C13.1 C14.1 C15.1 C16.1 C53.1 L4.2 U1.G12(A:VDD_CANUART) U1.G13(A:VDD_CORE) U1.G14(A:VDD_CORE) U1.G15(A:VDD_CORE) U1.G16(A:VDD_CORE) U1.H12(A:VDD_CORE) U1.H13(A:VDD_CORE) U1.H14(A:VDD_CORE) U1.H15(A:VDD_CORE) U1.H16(A:VDD_CORE) U1.J12(A:VDD_CORE) U1.J13(A:VDD_CORE) U1.J16(A:VDD_CORE) U1.K12(A:VDD_CORE) U1.K13(A:VDD_CORE) U1.K16(A:VDD_CORE) U1.L13(A:VDD_CORE) U1.L14(A:VDD_CORE) U1.L15(A:VDD_CORE) U1.M12(A:VDDA_CORE_USB) U1.M13(A:VDDA_CORE_CSIRX0) U6.1(FB_B1)
BUCK2-1P8: C21.1 C38.1 C49.1 L3.2 U1.C15(B:VMON_1P8_SOC) U6.20(PVIN_LDO2) U6.32(FB_B2)
BUCK3-1P2: C7.1 C8.1 C9.1 C47.1 L2.2 U1.K10(A:VDDS_DDR) U1.K11(A:VDDS_DDR) U1.L9(A:VDDS_DDR) U1.L10(A:VDDS_DDR) U1.L11(A:VDDS_DDR) U1.M8(A:VDDS_DDR) U1.M9(A:VDDS_DDR) U1.M10(A:VDDS_DDR) U1.N8(A:VDDS_DDR) U1.N9(A:VDDS_DDR) U6.24(FB_B3)
CH1_LVDS_A0N: J8.11 U1.P2(H:OLDI0_A0N)
CH1_LVDS_A0P: J8.12 U1.R1(H:OLDI0_A0P)
CH1_LVDS_A1N: J8.14 U1.R2(H:OLDI0_A1N)
CH1_LVDS_A1P: J8.15 U1.T1(H:OLDI0_A1P)
CH1_LVDS_A2N: J8.20 U1.T2(H:OLDI0_A2N)
CH1_LVDS_A2P: J8.21 U1.U2(H:OLDI0_A2P)
CH1_LVDS_A3N: J8.23 U1.U3(H:OLDI0_A3N)
CH1_LVDS_A3P: J8.24 U1.V3(H:OLDI0_A3P)
CH1_LVDS_CLKN: J8.17 U1.U8(H:OLDI0_CLK0N)
CH1_LVDS_CLKP: J8.18 U1.V8(H:OLDI0_CLK0P)
CH2_LVDS_A0N: J8.26 U1.U4(H:OLDI0_A4N)
CH2_LVDS_A0P: J8.27 U1.V4(H:OLDI0_A4P)
CH2_LVDS_A1N: J8.29 U1.U5(H:OLDI0_A5N)
CH2_LVDS_A1P: J8.30 U1.V5(H:OLDI0_A5P)
CH2_LVDS_A2N: J8.35 U1.U6(H:OLDI0_A6N)
CH2_LVDS_A2P: J8.36 U1.V6(H:OLDI0_A6P)
CH2_LVDS_A3N: J8.38 U1.U7(H:OLDI0_A7N)
CH2_LVDS_A3P: J8.39 U1.V7(H:OLDI0_A7P)
CH2_LVDS_CLKN: J8.32 U1.U9(H:OLDI0_CLK1N)
CH2_LVDS_CLKP: J8.33 U1.V9(H:OLDI0_CLK1P)
CLICK0_AN: JP3.1 R56.2 U7.3(VIN)
CLICK1_AN: JP4.40 R55.2 U8.3(VIN)
CSI0_RXCLKN: J4.8 U1.V17(F:CSI0_RXCLKN)
CSI0_RXCLKP: J4.9 U1.U17(F:CSI0_RXCLKP)
CSI0_RXN0: J4.2 U1.V16(F:CSI0_RXN0)
CSI0_RXN1: J4.5 U1.V15(F:CSI0_RXN1)
CSI0_RXP0: J4.3 U1.U16(F:CSI0_RXP0)
CSI0_RXP1: J4.6 U1.U15(F:CSI0_RXP1)
EEPROM_WP: J2.2 R7.1 U4.5(WP)
EMU0: R20.1 TC1.7 U1.D8(J:EMU0)
EMU1: R21.1 TC1.10 U1.C8(J:EMU1)
EXT_REFCLK1: R56.1 U1.D16(G:EXT_REFCLK1)
EXTINTN: R25.1 U1.C17(J:EXTINTN) U6.11(NINT)
GND: C1.2 C2.2 C3.2 C4.2 C5.2 C6.2 C7.2 C8.2 C9.2 C10.2 C11.2 C12.2 C13.2 C14.2 C15.2 C16.2 C17.2 C18.2 C19.2 C20.2 C21.2 C22.2 C23.2 C24.2 C25.- C26.2 C27.2 C28.2 C29.2 C31.2 C32.2 C33.2 C34.2 C35.2 C36.2 C37.2 C38.2 C39.2 C40.2 C41.2 C42.2 C43.2 C44.2 C45.2 C46.2 C47.2 C48.2 C49.2 C50.2 C51.2 C52.2 C53.2 C54.2 C55.2 C56.2 C57.2 C58.2 C59.2 C60.2 C61.2 C62.2 C63.2 D1.2(C) D2.2(C) D3.2(C) D4.2(C) D5.2(C) J2.1 J4.1 J4.4 J4.7 J4.10 J5.A1_B12(GND/A1/B12) J5.B1_A12(GND/A12/B1) J5.SH1_B(SH1) J5.SH1_T(SH1) J5.SH2_B(SH2) J5.SH2_T(SH2) J5.SH3_B(SH3) J5.SH3_T(SH3) J5.SH4_B(SH4) J5.SH4_T(SH4) J6.A1(GND) J6.A12(GND) J6.B1(GND) J6.B12(GND) J6.SH_B_1(SH1) J6.SH_B_2(SH2) J6.SH_B_3(SH3) J6.SH_B_4(SH4) J6.SH_T_1(SH1) J6.SH_T_2(SH2) J6.SH_T_3(SH3) J6.SH_T_4(SH4) J8.6 J8.7 J8.10 J8.13 J8.16 J8.19 J8.22 J8.25 J8.28 J8.31 J8.34 J8.37 J8.40 J8.S1(PAD1) J8.S2(PAD2) JP1.1 JP2.33 JP2.40 JP3.8 JP3.33 JP4.8 JP4.33 JP5.1 JP5.30 JP5.40 R1.1 R3.1 R4.2 R6.1 R14.1 R15.1 R26.2 R27.2 R29.2 R34.2 R35.1 R36.1 R37.2 R39.2 R40.2 R41.2 R42.2 R63.2 R76.1 S1.P$3 S1.P$4 TC1.3 TC1.5 U1.A2(C:VSS) U1.A14(C:VSS) U1.A27(C:VSS) U1.B1(C:VSS) U1.B14(C:VSS) U1.B28(C:VSS) U1.C3(C:VSS) U1.C4(C:VSS) U1.C14(C:VSS) U1.D3(C:VSS) U1.D4(C:VSS) U1.D14(C:VSS) U1.E3(C:VSS) U1.E4(C:VSS) U1.E5(C:VSS) U1.E6(C:VSS) U1.E7(C:VSS) U1.E8(C:VSS) U1.E9(C:VSS) U1.E10(C:VSS) U1.E11(C:VSS) U1.E12(C:VSS) U1.E13(C:VSS) U1.E16(C:VSS) U1.E17(C:VSS) U1.E18(C:VSS) U1.E19(C:VSS) U1.E20(C:VSS) U1.E21(C:VSS) U1.E22(C:VSS) U1.E23(C:VSS) U1.E24(C:VSS) U1.F19(C:VSS) U1.F20(C:VSS) U1.F21(C:VSS) U1.F22(C:VSS) U1.F23(C:VSS) U1.F24(C:VSS) U1.G2(E:MCU_OSC0_XO) U1.G19(C:VSS) U1.G20(C:VSS) U1.G23(C:VSS) U1.G24(C:VSS) U1.H2(D:WKUP_LFOSC0_XO) U1.H19(C:VSS) U1.H20(C:VSS) U1.H24(C:VSS) U1.J14(C:VSS) U1.J15(C:VSS) U1.J19(C:VSS) U1.J20(C:VSS) U1.J24(C:VSS) U1.K6(C:VSS) U1.K7(C:VSS) U1.K8(C:VSS) U1.K9(C:VSS) U1.K14(C:VSS) U1.K15(C:VSS) U1.K19(C:VSS) U1.K20(C:VSS) U1.K24(C:VSS) U1.L5(C:VSS) U1.L6(C:VSS) U1.L7(C:VSS) U1.L8(C:VSS) U1.L19(C:VSS) U1.L20(C:VSS) U1.L24(C:VSS) U1.M4(C:VSS) U1.M5(C:VSS) U1.M6(C:VSS) U1.M7(C:VSS) U1.M20(C:VSS) U1.M23(C:VSS) U1.M24(C:VSS) U1.N3(C:VSS) U1.N4(C:VSS) U1.N5(C:VSS) U1.N6(C:VSS) U1.N20(C:VSS) U1.N21(C:VSS) U1.N22(C:VSS) U1.N23(C:VSS) U1.N24(C:VSS) U1.P3(C:VSS) U1.P4(C:VSS) U1.P5(C:VSS) U1.P16(C:VSS) U1.P17(C:VSS) U1.P18(C:VSS) U1.P19(C:VSS) U1.P20(C:VSS) U1.P21(C:VSS) U1.P22(C:VSS) U1.P23(C:VSS) U1.P24(C:VSS) U1.R3(C:VSS) U1.R4(C:VSS) U1.T3(C:VSS) U1.T19(C:VSS) U1.U1(C:VSS) U1.U19(C:VSS) U1.U28(C:VSS) U1.V2(C:VSS) U1.V19(C:VSS) U1.V27(C:VSS) U2.4(GND) U3.4(GND) U4.2(VSS) U5.5(GND) U5.9(EXP) U6.15(AGND) U6.PAD U7.2(GND) U8.2(GND) U9.4(GND) U10.2(GND) U11.3(GND) U12.A1(1OEN) U12.D1(GND) U13.A1(1OEN) U13.D1(GND) U14.2(GND) U14.5(EP) X1.G0(GND) X1.G1(GND) X1.PIN6(VSS) Y1.2(GND) Y2.2(GND)
GPMC0_AD0: JP5.39 R51.1 U1.G28(G:GPMC0_AD0)
GPMC0_AD1: JP5.38 R49.1 U1.G27(G:GPMC0_AD1)
GPMC0_AD2: JP5.37 R42.1 U1.F28(G:GPMC0_AD2)
GPMC0_AD3: JP5.36 R41.1 U1.F27(G:GPMC0_AD3)
GPMC0_AD4: JP5.35 R40.1 U1.E28(G:GPMC0_AD4)
GPMC0_AD5: JP5.34 R39.1 U1.E27(G:GPMC0_AD5)
GPMC0_AD6: JP5.33 R38.1 U1.D28(G:GPMC0_AD6)
GPMC0_AD7: JP5.32 R37.1 U1.D27(G:GPMC0_AD7)
GPMC0_AD8: JP2.29 R34.1 U1.L27(G:GPMC0_AD8)
GPMC0_AD9: JP3.29 R32.1 U1.L28(G:GPMC0_AD9)
GPMC0_AD10: JP2.30 R31.1 U1.K27(G:GPMC0_AD10)
GPMC0_AD11: JP3.30 R30.1 U1.K28(G:GPMC0_AD11)
GPMC0_AD12: JP2.31 R29.1 U1.J28(G:GPMC0_AD12)
GPMC0_AD13: JP3.31 R28.1 U1.J27(G:GPMC0_AD13)
GPMC0_AD14: JP2.32 R27.1 U1.H28(G:GPMC0_AD14)
GPMC0_AD15: JP3.32 R26.1 U1.H27(G:GPMC0_AD15)
GPMC0_ADVN_ALE: JP4.31 U1.H25(G:GPMC0_ADVN_ALE)
GPMC0_BE0N_CLE: JP2.38 U1.J26(G:GPMC0_BE0N_CLE)
GPMC0_BE1N: JP2.36 U1.K25(G:GPMC0_BE1N)
GPMC0_CLK: JP2.37 U1.K26(G:GPMC0_CLK)
GPMC0_CSN0: JP4.29 U1.F26(G:GPMC0_CSN0)
GPMC0_CSN1: JP5.29 U1.F25(G:GPMC0_CSN1)
GPMC0_CSN2: JP4.28 U1.E26(G:GPMC0_CSN2)
GPMC0_CSN3: JP5.28 U1.E25(G:GPMC0_CSN3)
GPMC0_DIR: JP4.30 U1.G25(G:GPMC0_DIR)
GPMC0_OEN_REN: JP4.32 U1.H26(G:GPMC0_OEN_REN)
GPMC0_WAIT0: JP2.34 U1.L25(G:GPMC0_WAIT0)
GPMC0_WAIT1: JP2.35 U1.L26(G:GPMC0_WAIT1)
GPMC0_WEN: JP2.39 U1.J25(G:GPMC0_WEN)
GPMC0_WPN: JP5.31 U1.G26(G:GPMC0_WPN)
I2C0_SCL: J7.2 J8.2 R52.1 U1.A12(G:I2C0_SCL) U4.1(SCL) U6.10(SCL) U7.5(SCL) U8.5(SCL)
I2C0_SDA: J7.1 J8.3 R53.1 U1.B12(G:I2C0_SDA) U4.3(SDA) U6.9(SDA) U7.6(SDA) U8.6(SDA)
I2C1_SCL: JP3.36 R69.1 U1.A13(G:I2C1_SCL)
I2C1_SDA: JP3.35 R70.1 U1.B13(G:I2C1_SDA)
LDO1-1P8-3P3: C23.1 C42.1 R43.2 R44.2 R45.2 R46.2 R47.2 U1.G21(B:VDDSHV5) U1.G22(B:VDDSHV5) U6.7(VLDO1)
LDO2-0P85: C17.1 C18.1 C19.1 C43.1 U1.H17(A:VDDR_CORE) U1.H18(A:VDDR_CORE) U1.J17(A:VDDR_CORE) U1.J18(A:VDDR_CORE) U1.K17(A:VDDR_CORE) U1.K18(A:VDDR_CORE) U1.L17(A:VDDR_CORE) U1.L18(A:VDDR_CORE) U6.19(VLDO2)
LDO3-1P8: C1.1 C2.1 C3.1 C4.1 C5.1 C44.1 C46.1 C54.1 R24.2 R50.1 U1.D15(A:VDDS_OSC0) U1.F13(A:VDDA_MCU) U1.F14(A:VDDA_PLL2) U1.N12(A:VDDA_TEMP) U1.N13(A:VDDA_PLL0) U1.N14(A:VDDA_PLL1) U1.P11(A:VDDA_1P8_OLDI0) U1.P12(A:VDDA_1P8_USB) U1.P13(A:VDDA_1P8_CSIRX0) U6.21(VLDO3) Y1.4(VDD) Y2.4(VDD)
LDO4-2P5: C20.1 C45.1 U1.N10(A:DDR_VPP) U6.23(VLDO4)
LED1: D1.1(A) R57.1
LED2: D2.1(A) R58.1
LED3: D3.1(A) R59.1
LED4: D4.1(A) R60.1
LED5: D5.1(A) R61.1
LX_B1: L4.1 U6.2(LX_B1_1) U6.3(LX_B1_2)
LX_B2: L3.1 U6.29(LX_B2)
LX_B3: L2.1 U6.27(LX_B3)
MCAN0_RX: JP3.37 U1.A11(G:MCAN0_RX)
MCAN0_TX: JP3.38 U1.B11(G:MCAN0_TX)
MCASP0_ACLKR: JP3.39 U1.B19(G:MCASP0_ACLKR)
MCASP0_ACLKX: R58.2 U1.A18(G:MCASP0_ACLKX)
MCASP0_AFSR: JP3.40 U1.A19(G:MCASP0_AFSR)
MCASP0_AFSX: R59.2 U1.B18(G:MCASP0_AFSX)
MCASP0_AXR0: R60.2 U1.B17(G:MCASP0_AXR0)
MCASP0_AXR1: R61.2 U1.A17(G:MCASP0_AXR1)
MCASP0_AXR2: JP4.39 U1.B16(G:MCASP0_AXR2)
MCASP0_AXR3: R55.1 U1.A16(G:MCASP0_AXR3)
MCU_ERRORN: TP2.TP U1.D7(E:MCU_ERRORN)
MCU_I2C0_SCL: JP5.14 R65.1 U1.A7(E:MCU_I2C0_SCL)
MCU_I2C0_SDA: JP4.14 R66.1 U1.B7(E:MCU_I2C0_SDA)
MCU_MCAN0_RX: JP5.4 U1.E1(E:MCU_MCAN0_RX)
MCU_MCAN0_TX: JP5.5 U1.E2(E:MCU_MCAN0_TX)
MCU_MCAN1_RX: JP5.2 U1.F1(E:MCU_MCAN1_RX)
MCU_MCAN1_TX: JP5.3 U1.F2(E:MCU_MCAN1_TX)
MCU_OSC0_XI: U1.G1(E:MCU_OSC0_XI) Y2.3(OUT)
MCU_PORZ: JP4.15 R24.1 U1.D6(E:MCU_PORZ) U6.18(NRSTOUT)
MCU_RESETSTATZ: TP3.TP U1.C6(E:MCU_RESETSTATZ)
MCU_RESETZ: R10.1 U1.C5(E:MCU_RESETZ)
MCU_SPI0_CLK: JP4.11 U1.A4(E:MCU_SPI0_CLK)
MCU_SPI0_CS0: JP5.13 U1.B6(E:MCU_SPI0_CS0)
MCU_SPI0_CS1: JP4.13 U1.A6(E:MCU_SPI0_CS1)
MCU_SPI0_D0: JP5.12 U1.B5(E:MCU_SPI0_D0)
MCU_SPI0_D1: JP4.12 U1.A5(E:MCU_SPI0_D1)
MCU_UART0_CTSN: JP5.11 U1.B4(E:MCU_UART0_CTSN)
MCU_UART0_RTSN: JP4.10 U1.A3(E:MCU_UART0_RTSN)
MCU_UART0_RXD: JP4.9 U1.B2(E:MCU_UART0_RXD)
MCU_UART0_TXD: JP5.10 U1.B3(E:MCU_UART0_TXD)
MDIO0_MDC: JP3.12 U1.V26(G:MDIO0_MDC)
MDIO0_MDIO: JP2.12 U1.U26(G:MDIO0_MDIO)
MMC0_CLK: JP4.5 R67.1 U1.J1(G:MMC0_CLK)
MMC0_CMD: JP4.6 R68.1 U1.K1(G:MMC0_CMD)
MMC0_DAT0: JP3.4 U1.K2(G:MMC0_DAT0)
MMC0_DAT1: JP3.3 U1.L1(G:MMC0_DAT1)
MMC0_DAT2: JP4.1 U1.L2(G:MMC0_DAT2)
MMC0_DAT3: JP4.2 U1.M1(G:MMC0_DAT3)
MMC0_DAT4: JP3.6 U1.M2(G:MMC0_DAT4)
MMC0_DAT5: JP3.5 U1.N1(G:MMC0_DAT5)
MMC0_DAT6: JP4.4 U1.N2(G:MMC0_DAT6)
MMC0_DAT7: JP4.3 U1.P1(G:MMC0_DAT7)
MMC1_CLK: R33.2 U1.B21(G:MMC1_CLK)
MMC1_CLK_R: R33.1 X1.PIN5(CLK)
MMC1_CMD: R45.1 U1.A21(G:MMC1_CMD) X1.PIN3(CMD)
MMC1_DAT0: R46.1 U1.A22(G:MMC1_DAT0) X1.PIN7(DAT0)
MMC1_DAT1: R47.1 U1.B22(G:MMC1_DAT1) X1.PIN8(DAT1)
MMC1_DAT2: R43.1 U1.A20(G:MMC1_DAT2) X1.PIN1(DAT2)
MMC1_DAT3: R44.1 U1.B20(G:MMC1_DAT3) X1.PIN2(CD/DAT3)
MMC1_SDCD: U1.A23(G:MMC1_SDCD) U11.4(Y)
MMC1_SDWP: R13.1 U1.B23(G:MMC1_SDWP) U6.12(VSEL_SD/VSEL_DDR)
MMC2_CLK: JP4.20 U1.D23(G:MMC2_CLK)
MMC2_CMD: JP5.20 U1.C23(G:MMC2_CMD)
MMC2_DAT0: JP5.19 U1.D22(G:MMC2_DAT0)
MMC2_DAT1: JP4.19 U1.C22(G:MMC2_DAT1)
MMC2_DAT2: JP5.18 U1.D21(G:MMC2_DAT2)
MMC2_DAT3: JP4.18 U1.C21(G:MMC2_DAT3)
MMC2_SDCD: JP5.17 U1.D20(G:MMC2_SDCD)
MMC2_SDWP: JP4.17 U1.C20(G:MMC2_SDWP)
MPU_HFOSC_EN: R50.2 Y2.1(ST)
OSPI0_CLK: JP4.23 U1.A24(H:OSPI0_CLK)
OSPI0_CSN0: JP4.22 U1.D25(H:OSPI0_CSN0)
OSPI0_CSN1: D7.CATHODE(C) U1.C25(H:OSPI0_CSN1)
OSPI0_CSN2: JP4.21 U1.D24(H:OSPI0_CSN2)
OSPI0_CSN3: JP5.21 U1.C24(H:OSPI0_CSN3)
OSPI0_D0: JP5.24 U1.B24(H:OSPI0_D0)
OSPI0_D1: JP4.24 U1.A25(H:OSPI0_D1)
OSPI0_D2: JP5.25 U1.B25(H:OSPI0_D2)
OSPI0_D3: JP4.25 U1.A26(H:OSPI0_D3)
OSPI0_D4: JP5.26 U1.B26(H:OSPI0_D4)
OSPI0_D5: JP4.26 U1.B27(H:OSPI0_D5)
OSPI0_D6: JP5.27 U1.C27(H:OSPI0_D6)
OSPI0_D7: JP4.27 U1.C28(H:OSPI0_D7)
OSPI0_DQS: JP5.23 U1.D26(H:OSPI0_DQS)
OSPI0_LBCLKO: JP5.22 R74.2 U1.C26(H:OSPI0_LBCLKO)
OSPI0_LBCLKO_R: J1.1 R74.1 U13.C1(2Y)
PMIC_LPM_EN0: R23.1 U1.D5(J:PMIC_LPM_EN0) U6.31(MODE_STBY)
PMIC_PWR_BTN: R22.1 S1.P$1 S1.P$2 U6.25(EN/PB/VSENSE)
PORZ_OUT: TP1.TP U1.D18(J:PORZ_OUT)
RESET_REQZ: R11.1 U1.D17(J:RESET_REQZ)
RESETSTATZ: D6.CATHODE(C) U1.C18(J:RESETSTATZ) U6.28(MODE_RESET) U13.B1(1A)
RGMII1_RD0: JP2.8 U1.U22(G:RGMII1_RD0)
RGMII1_RD1: JP2.7 U1.V22(G:RGMII1_RD1)
RGMII1_RD2: JP2.6 U1.U21(G:RGMII1_RD2)
RGMII1_RD3: JP2.5 U1.V21(G:RGMII1_RD3)
RGMII1_RX_CTL: JP2.3 U1.V20(G:RGMII1_RX_CTL)
RGMII1_RXC: JP2.4 U1.U20(G:RGMII1_RXC)
RGMII1_TD0: JP2.11 U1.U25(G:RGMII1_TD0)
RGMII1_TD1: JP3.11 U1.V25(G:RGMII1_TD1)
RGMII1_TD2: JP2.10 U1.U24(G:RGMII1_TD2)
RGMII1_TD3: JP3.10 U1.V24(G:RGMII1_TD3)
RGMII1_TX_CTL: JP3.9 U1.V23(G:RGMII1_TX_CTL)
RGMII1_TXC: JP2.9 U1.U23(G:RGMII1_TXC)
RGMII2_RD0: JP2.18 U1.T25(G:RGMII2_RD0)
RGMII2_RD1: JP3.18 U1.R24(G:RGMII2_RD1)
RGMII2_RD2: JP2.17 U1.T24(G:RGMII2_RD2)
RGMII2_RD3: JP3.17 U1.R23(G:RGMII2_RD3)
RGMII2_RX_CTL: JP2.16 U1.T23(G:RGMII2_RX_CTL)
RGMII2_RXC: JP3.16 U1.R22(G:RGMII2_RXC)
RGMII2_TD0: JP2.15 U1.T22(G:RGMII2_TD0)
RGMII2_TD1: JP3.15 U1.R21(G:RGMII2_TD1)
RGMII2_TD2: JP2.14 U1.T21(G:RGMII2_TD2)
RGMII2_TD3: JP3.14 U1.R20(G:RGMII2_TD3)
RGMII2_TX_CTL: JP2.13 U1.T20(G:RGMII2_TX_CTL)
RGMII2_TXC: JP3.13 U1.R19(G:RGMII2_TXC)
RXD: JP1.2 R76.2 U12.B1(1A)
SD_LS_ON: D6.ANODE(A) D7.ANODE(A) R54.2 U10.3(ON)
SDCD_INV: R48.1 U11.2(A) X1.PIN9(DET) X1.PIN10(DET)
SPI0_CLK: JP4.37 U1.C11(G:SPI0_CLK)
SPI0_CS0: JP4.38 U1.D13(G:SPI0_CS0)
SPI0_CS1: JP3.2 U1.C13(G:SPI0_CS1)
SPI0_D0: JP4.36 U1.D12(G:SPI0_D0)
SPI0_D1: JP4.35 U1.C12(G:SPI0_D1)
TCK: R19.1 TC1.4 U1.D9(J:TCK)
TDI: R17.1 TC1.8 U1.D10(J:TDI)
TDO: TC1.6 U1.D11(J:TDO)
TMS: R18.1 TC1.2 U1.C10(J:TMS)
TPS22965_CT: C28.1 U5.6(CT)
TPS22965_EN: R73.1 U5.3(ON) U6.17(GPO2)
TRSTN: R14.2 TC1.9 U1.C9(J:TRSTN)
TS_INT#: J8.9 TP7.TP U13.D2(2A)
TS_RESET_N: J8.8 TP6.TP U13.C2(1Y)
TXD: JP1.3 U12.C1(2Y)
UART0_CTSN: JP4.16 U1.A9(G:UART0_CTSN)
UART0_RTSN: JP5.16 U1.B9(G:UART0_RTSN)
UART0_RXD: U1.A10(G:UART0_RXD) U12.C2(1Y)
UART0_TXD: U1.B10(G:UART0_TXD) U12.D2(2A)
USB0_CC1: J5.A5(CC1) R35.2
USB0_CC2: J5.B5(CC2) R36.2
USB0_DM: J5.A7(DN1) J5.B7(DN2) U1.U12(I:USB0_DM) U9.2(D-)
USB0_DP: J5.A6(DP1) J5.B6(DP2) U1.V12(I:USB0_DP) U9.1(D+)
USB0_DRVVBUS: J4.11 U1.C19(I:USB0_DRVVBUS)
USB0_VBUS: R62.1 R63.1 U1.V11(I:USB0_VBUS)
USB1_CC1: J6.A5(CC1) R72.1
USB1_CC2: J6.B5(CC2) R71.1
USB1_DM: J6.A7(DN1) J6.B7(DN2) U1.U10(I:USB1_DM) U2.2(D-)
USB1_DP: J6.A6(DP1) J6.B6(DP2) U1.V10(I:USB1_DP) U2.1(D+)
USB1_DRVVBUS: J4.12 U1.D19(I:USB1_DRVVBUS)
USB1_VBUS: R4.1 R5.1 U1.U11(I:USB1_VBUS)
VBUS: C50.1 C60.1 D8.A J5.A4_B9(VBUS/A4/B9) J5.B4_A9(VBUS/A9/B4) U9.6(VBUS)
VDD1P8_CAP: C41.1 U6.14(VDD1P8)
VDD_SD: C57.1 C58.1 U10.5(QOD) U10.6(VOUT) X1.PIN4(VDD)
VIN-3P3: C30.2 C31.1 C32.1 C33.1 C39.1 C40.1 C48.1 C51.1 C52.1 L1.2 R9.1 R22.2 R73.2 U5.1(VIN) U5.2(VIN) U5.4(VBIAS) U6.4(PVIN_B1_1) U6.5(PVIN_B1_2) U6.6(PVIN_LDO1) U6.13(VSYS) U6.22(PVIN_LDO34) U6.26(PVIN_B3) U6.30(PVIN_B2)
VIN-3P3-LS: C6.1 C22.1 C26.1 C29.1 C34.1 C35.1 C36.1 C37.1 C61.1 C63.1 J4.15 J8.1 JP2.2 JP3.7 JP4.34 R7.2 R10.2 R11.2 R12.2 R13.2 R16.2 R17.2 R18.2 R19.2 R20.2 R21.2 R23.2 R25.2 R28.2 R30.2 R31.2 R32.2 R38.2 R48.2 R49.2 R51.2 R52.2 R53.2 R54.1 R57.2 R64.2 R65.2 R66.2 R67.2 R68.2 R69.2 R70.2 TC1.1 U1.B15(B:VMON_3P3_SOC) U1.F11(B:VDDSHV_CANUART) U1.F12(B:VDDSHV_MCU) U1.G10(B:VDDSHV_CANUART) U1.G11(B:VDDSHV_MCU) U1.H21(B:VDDSHV6) U1.H22(B:VDDSHV6) U1.J21(B:VDDSHV0) U1.J22(B:VDDSHV0) U1.K21(B:VDDSHV1) U1.K22(B:VDDSHV1) U1.L21(B:VDDSHV3) U1.L22(B:VDDSHV3) U1.M21(B:VDDSHV2) U1.M22(B:VDDSHV2) U1.N7(A:VDDA_3P3_USB) U1.N11(B:VDDSHV4) U1.P10(B:VDDSHV4) U4.4(VCC) U5.7(VOUT) U5.8(VOUT) U7.1(VA) U8.1(VA) U10.1(VIN) U11.6(VCC) U12.A2(VCC) U12.B2(2OE) U13.A2(VCC) U13.B2(2OE) U14.4(IN)
VIN-5P0: C24.1 C25.+ C27.1 C55.1 C56.1 C59.1 D8.C J6.A4(VBUS) J6.A9(VBUS) J6.B4(VBUS) J6.B9(VBUS) JP2.1 JP3.34 JP4.7 R2.2 R5.2 R62.2 R71.2 R72.2 U2.6(VBUS) U3.1(EN) U3.6(VIN)
VMON_ER_SYS: R1.2 R2.1 U1.A15(B:VMON_VSYS)
VOUT0_DATA0: JP2.21 U1.P26(H:VOUT0_DATA0)
VOUT0_DATA1: JP3.21 U1.N25(H:VOUT0_DATA1)
VOUT0_DATA2: JP2.22 U1.N26(H:VOUT0_DATA2)
VOUT0_DATA3: JP3.22 U1.M25(H:VOUT0_DATA3)
VOUT0_DATA4: JP2.23 U1.M26(H:VOUT0_DATA4)
VOUT0_DATA5: JP3.23 U1.U27(H:VOUT0_DATA5)
VOUT0_DATA6: JP2.24 U1.T27(H:VOUT0_DATA6)
VOUT0_DATA7: JP3.24 U1.T28(H:VOUT0_DATA7)
VOUT0_DATA8: JP2.25 U1.R27(H:VOUT0_DATA8)
VOUT0_DATA9: JP3.25 U1.R28(H:VOUT0_DATA9)
VOUT0_DATA10: JP2.26 U1.P27(H:VOUT0_DATA10)
VOUT0_DATA11: JP3.26 U1.P28(H:VOUT0_DATA11)
VOUT0_DATA12: JP2.27 U1.N27(H:VOUT0_DATA12)
VOUT0_DATA13: JP3.27 U1.N28(H:VOUT0_DATA13)
VOUT0_DATA14: JP2.28 U1.M27(H:VOUT0_DATA14)
VOUT0_DATA15: JP3.28 U1.M28(H:VOUT0_DATA15)
VOUT0_DE: JP2.19 U1.R25(H:VOUT0_DE)
VOUT0_HSYNC: JP3.20 U1.P25(H:VOUT0_HSYNC)
VOUT0_PCLK: JP3.19 U1.T26(H:VOUT0_PCLK)
VOUT0_VSYNC: JP2.20 U1.R26(H:VOUT0_VSYNC)
VPP: C62.1 U1.C16(A:VPP) U14.1(OUT)
VPP_EN: J1.2 R3.2 U14.3(EN)
WKUP_CLKOUT0: JP5.15 U1.C7(D:WKUP_CLKOUT0)
WKUP_I2C0_SCL: J4.13 R64.1 U1.A8(D:WKUP_I2C0_SCL)
WKUP_I2C0_SDA: J4.14 R12.1 U1.B8(D:WKUP_I2C0_SDA)
WKUP_LFOSC0_XI: U1.H1(D:WKUP_LFOSC0_XI) Y1.3(OUT)
WKUP_UART0_CTSN: JP5.6 U1.D1(D:WKUP_UART0_CTSN)
WKUP_UART0_RTSN: JP5.7 U1.D2(D:WKUP_UART0_RTSN)
WKUP_UART0_RXD: JP5.9 U1.C2(D:WKUP_UART0_RXD)
WKUP_UART0_TXD: JP5.8 U1.C1(D:WKUP_UART0_TXD)
Unconnected: FUD1.P$1 FUD2.P$1 FUD3.P$1 FUD4.P$1 FUD5.P$1 FUD6.P$1 J4.1_1 J4.2_1 J4.3_1 J4.4_1 J4.5_1 J4.6_1 J4.7_1 J4.8_1 J4.9_1 J4.10_1 J4.11_1 J4.12_1 J4.13_1 J4.14_1 J4.15_1 J5.A8(SBU1) J5.B8(SBU2) J6.A8(SBU1) J6.B8(SBU2) J8.4 J8.5 U1.E14(M:NC_01) U1.E15(M:NC_02) U1.F3(M:NC_03) U1.F4(K:AM62X_RSVD1) U1.F5(K:AM62X_RSVD0) U1.F6(K:AM62X_RSVD2) U1.F7(K:AM62X_RSVD8) U1.F8(K:AM62X_RSVD4) U1.F9(K:AM62X_RSVD5) U1.F10(K:DDR_RSVD0) U1.F15(L:AM62X_DNU11) U1.F16(L:AM62X_DNU12) U1.F17(M:NC_04) U1.F18(M:NC_05) U1.G3(M:NC_06) U1.G4(M:NC_07) U1.G5(M:NC_08) U1.G6(M:NC_09) U1.G7(M:NC_10) U1.G8(M:NC_11) U1.G9(M:NC_12) U1.G17(M:NC_13) U1.G18(M:NC_14) U1.H3(M:NC_15) U1.H4(M:NC_16) U1.H5(M:NC_17) U1.H6(M:NC_18) U1.H7(M:NC_19) U1.H8(M:NC_20) U1.H9(M:NC_21) U1.H10(M:NC_22) U1.H11(M:NC_23) U1.H23(M:NC_24) U1.J2(L:AM62X_DNU13) U1.J3(M:NC_25) U1.J4(M:NC_26) U1.J5(M:NC_27) U1.J6(M:NC_28) U1.J7(M:NC_29) U1.J8(M:NC_30) U1.J9(M:NC_31) U1.J10(M:NC_32) U1.J11(M:NC_33) U1.J23(M:NC_34) U1.K3(M:NC_35) U1.K4(M:NC_36) U1.K5(M:NC_37) U1.K23(M:NC_38) U1.L3(M:NC_39) U1.L4(M:NC_40) U1.L12(M:NC_41) U1.L16(M:NC_42) U1.L23(M:NC_43) U1.M3(M:NC_44) U1.M11(M:NC_45) U1.M14(L:AM62X_DNU10) U1.M15(M:NC_46) U1.M16(M:NC_47) U1.M17(M:NC_48) U1.M18(K:AM62X_RSVD6) U1.M19(L:AM62X_DNU14) U1.N15(M:NC_49) U1.N16(M:NC_50) U1.N17(K:AM62X_RSVD3) U1.N18(K:AM62X_RSVD7) U1.N19(L:AM62X_DNU15) U1.P6(M:NC_51) U1.P7(M:NC_52) U1.P8(M:NC_53) U1.P9(M:NC_54) U1.P14(M:NC_55) U1.P15(M:NC_56) U1.R5(M:NC_57) U1.R6(M:NC_58) U1.R7(M:NC_59) U1.R8(M:NC_60) U1.R9(M:NC_61) U1.R10(M:NC_62) U1.R11(M:NC_63) U1.R12(M:NC_64) U1.R13(M:NC_65) U1.R14(M:NC_66) U1.R15(L:AM62X_DNU9) U1.R16(L:AM62X_DNU8) U1.R17(L:AM62X_DNU7) U1.R18(L:AM62X_DNU6) U1.T4(M:NC_67) U1.T5(M:NC_68) U1.T6(M:NC_69) U1.T7(M:NC_70) U1.T8(M:NC_71) U1.T9(M:NC_72) U1.T10(M:NC_73) U1.T11(M:NC_74) U1.T12(M:NC_75) U1.T13(M:NC_76) U1.T14(M:NC_77) U1.T15(L:AM62X_DNU5) U1.T16(L:AM62X_DNU4) U1.T17(L:AM62X_DNU3) U1.T18(L:AM62X_DNU2) U1.U13(F:CSI0_RXN3) U1.U14(F:CSI0_RXN2) U1.U18(L:AM62X_DNU1) U1.V13(F:CSI0_RXP3) U1.V14(F:CSI0_RXP2) U1.V18(L:AM62X_DNU0) U2.3(ID) U2.5(N.C.) U3.2(PG) U6.8(GPO1) U6.16(GPIO) U9.3(ID) U9.5(N.C.) U10.4(CT) U11.1(NC) U11.5(NC) Y1.1(NC)

## Notes on the sheet
- IO Headers | OLDI / LVDS Display Interface | Design Notes
- Connectors support two (2) Mikroe Click Interfaces on the inner headers (East / West)
- Based on AM62x SKEVM with Fulton PMIC
- Supports:  SK-LCD1 Interface (https://www.ti.com/tool/SK-LCD1)
- Revision 1A
    - Intial Revision - Pre-Production
  
  Revision 1B
    - Fixed issue with USB connector shorting power and ground
    - Updated SD card connections to fix UHS-I speed transition
    - Updated PC / PD headers
  
  Revision 1C
    - Added inverter on microSD card CD pin
    - Added back current protection for USB-C UFP connector
    - Added LVDS connector
    - Moved all components to top side of the board (except LVDS connector) 
  
  Revision 1D
    - Added buffer for UART
    - Added buffer for LVDS
    - Updated LVDS documentation
    - Added LDO for VPP per AM62x SKEVM
- SOUTH Connector | NORTH Connector | Need a 40 pin FPC cable 0.5mm pitch  (A Type) cable to connect to the screen.
- WEST
- GPIO1_30 | PWM1_A
- 1 | GPIO1_16 | GPIO1_36
- LVDS length requirements:
    - Inter pair:  0.15mm
    - Intra pair:  5mm
- CS0 | CLICK 0
- CLK | UART2
- D0
- SPI2 | D1 | I2C3
- Buffer to prevent back current on INT / RESET
- This Page Intentionally Left Blank
- I2C1 | CLICK 1 | SPI0
- 40 | UART5
- GPIO1_14 | GPIO1_8
- PWM0_A
- EAST
- GPIO1_7
- PA | PB | PC | PD
- Click Modules come with I2C pull ups on-board.  
  Footprints added on I2C1 and I2C3 for convenience (see other page).
- GPMC[0:15] are used as boot mode pins and have default pull up / pull 
  down behavior.  See "Boot Mode" section for more information.
- To meet the Mikroe Click standard, a resistor mux is used to add GPIO
  functionality to the CLICK0_AN and CLICK1_AN pins.  This is generally 
  not needed in a design based on the OSD62-PM-BRK.
- 9/12 | 1D | 10/12 | 1D | 11/12 | 1D | 12/12 | 1D
- SD Power Load switch
- USB-C Back Current Protection
  Allows USB connection when 
  board is externally powered.
  (Max Vf = 400mV @ 2A)
- I2C0 Pull-up Resistors
- Boot Modes Decode:
    1, PLL Config     B[2:0]     = 0b011          : Ref Clock = 25MHz
    2, Primary Boot  B[9:3]     = 0b1001000 : SDCard FS Boot
    3, Backup Boot  B[13:10] = 0b1011        : UART Boot
- OSD62-PM Signals | USB-C Connector | Oscillators | Power Management | Boot Mode | MicroSD
- Test Points for unused control signals. | Only supports USB2.0; Cannot supply power
- See https://www.ti.com/lit/an/slvafd0a/slvafd0a.pdf
    - Using TPS6521903
- OSD62x 25 MHz Oscillator | OSD62x 32 kHz Oscillator
- UFP Request:  3.0A
- 1.8V only | 1.8V only
- I2C Address:  0x30 (7-bit)
- BOOTMODE 0 | 1
- TFM201610ALC-R47MTAA | BOOTMODE 1 | 1
- Note: VDDSHV5 is used for this interface.
  LDO1 from the PMIC supports both 1.8V
  and 3.3V operation to support SD3.0 speed
- BOOTMODE 2 | 0
- BOOTMODE 3 | 0
- Unused | BOOTMODE 4 | 0
- BOOTMODE 5 | 0
- USBx_VBUS is a power sense 
  input to the AM6254 and 
  must be scaled (see AM6254
  datasheet Section 9.2.3)
- BOOTMODE 6 | 1
- Note: The AM62x ROM code requires CD 
  to have an active-low polarity.  Depending 
  on the CD polarity of the SD card holder
  you may need to add an inverter as shown.
- BOOTMODE 7 | 0
- BOOTMODE 8 | 0
- Unused | AOTA-B160808SR47MT | BOOTMODE 9 | 1
- BOOTMODE 10 | 1
- BOOTMODE 11 | 1
- BOOTMODE 12 | 0
- Note:  It is recommended to add a 
  pull-down on MMC_CLK signal to 
  hold the signal LOW when AM62x 
  IO buffers are not active.
- BOOTMODE 13 | 1
- Pull-up Resistors | BOOTMODE 14 | 0
- BOOTMODE 15 | 0
- CSI Connector | LEDs | Power Button
- Compatible with Raspberry Pi camera connector
- AM62 JTAG Resistors
- ADCs | JTAG Headers
- CSI length requirements:
    - Inter pair:  0.15mm
    - Intra pair:  1.5mm
- For Click Connectors
- Tag Connect
- GPIO1_50
- GPIO1_51
- Oscillator used 
  instead of Crystal
- AM62 Reset Resistors
- USR2 | USR3 | USR1 | USR0
- I2C Addr:  0x51 | I2C Addr:  0x52
- GPIO1_49
- 3.3V DC-DC Converter | I2C Pull Ups
- Pull up resistors are required for the MCU and WKUP I2C busses 
  regardless of use.
- Main 3.3V Input
- No pull ups required for the Click I2C Interfaces, per spec.
  Footprints on back of board added for conveniece.
- TFM201610ALC-R47MTAA
- PMIC_VSEL_SD requires an external pull up to the voltage of the IO bank that drives it.
  This is VDDSHV0, i.e. VIN-3P3-LS, (MMC1_SDWP) for this design.
- GPO2 is enabled in the TPS6521903 configuration 
  and used by the PMIC to enable the 3.3V load switch.
- EEPROM | USB Connector | UART Header
- Vertical USB Host Port (Type-C) | Buffer added to prevent back current
- Oscillator used 
  instead of Crystal
- See https://www.ti.com/lit/ug/slvucj2a/slvucj2a.pdf for more information on the "03" configuration of the TPS65219.
- See https://octavosystems.com/app_notes/osd62x-pm-power-application-note/ for an in-depth discusion of the TPS65219.
- USBx_VBUS is a power sense 
  input to the AM6254 and 
  must be scaled (see AM6254
  datasheet Section 9.2.3)
- Note:  MCU_ERRORn must be connected to VSS with external pull resistor 
  in order to hold the pin to a logic LOW level if connected to another device 
  or if it has a long trace to a test point that could be suseptible to noise.
- Click 0
- Click 1
- 4A DC-DC converter | 6A Load Switch
- DFP Advertisement:  
      Default USB Power (500mA/900mA)
- 5/12 | 1D | 6/12 | 1D | 7/12 | 1D | 8/12 | 1D
- 0201 | 0402
- Table of Contents | Power Block Diagram | OSD62-PM Power
- Octavo Systems OSD62-PM-BRK
  
  (c) Copyright, Octavo Systems LLC, 2024-2025. All Rights Reserved.
- 0.01uF | 0.1uF | 1uF | 2.2uF | 4.7uF | 10uF | OSD62-PM Ground | OSD62-PM I/O Power | OSD62-PM Reserved / DNU
- Power Connections for the OSD62-PM
- Sheet 1:  Title
- All IO to headers on OSD62-PM are 3.3V.
  
  Other designs will need to set VDDSHV banks to meet their IO voltage needs.
- These pins are reserved and should not be connected or routed thru.
- VDD_CORE | 0/3 | 1/0 | 1/0 | 0/1
- TLV62595 | TPS6521903 | OSD62-PM
- Sheet 2:  Notes / Block Diagram / Mechanical
- 3.3V | 0.75V | 0.75V @ 3.5A
- Buck 1 
  0.75V @ 2850mA
- VDDA_CORE_CSIRX0 | 1/0 | 0/1 | 0/0
- 5.0V USB-C
  External Input
- VIN-B1/2/3 | Buck 1 | VDD_CORE | VDDA_CORE_CSIRX0
- Sheet 3:  OSD62-PM Power | VDD_CANUART | VDDA_CORE_USB
- Buck 1
  (0.75 V)
- VDDA_DDR_PLL0 | VDDA_CORE_USB | 1/0 | 0/1
- USB-C
  UFP
- DC-DC 4A
  5.0V to 3.3V
- 1.8V @ 2A
- Buck 2 
  1.8V @ 400mA
- 20mA
- Sheet 4:  OSD62-PM GND / IO Power
- USB-C Back
  Current Protection
- VIN-LDO1 | Buck 2
- TLV75518P
  LDO
- VPP
- VIN-LDO34 | 20mA | VDD_CANUART | 1/0 | 0/1
- THERE IS NO WARRANTY FOR THIS DESIGN, TO THE EXTENT PERMITTED BY APPLICABLE 
  LAW. EXCEPT WHEN OTHERWISE STATED IN WRITING THE COPYRIGHT HOLDERS AND/OR 
  OTHER PARTIES PROVIDE THE DESIGN *AS IS* WITHOUT WARRANTY OF ANY KIND, 
  EITHER EXPRESSED OR IMPLIED, INCLUDING, BUT NOT LIMITED TO, THE IMPLIED 
  WARRANTIES OF MERCHANTABILITY AND FITNESS A FOR A PARTICULAR PURPOSE. 
  THE ENTIRE RISK AS TO THE QUALITY AND PERFORMANCE OF THE DESIGN IS WITH YOU. 
  SHOULD THE DESIGN PROVE DEFECTIVE, YOU ASSUME THE COST OF ALL NECESSARY 
  SERVICING, REPAIR OR CORRECTION.
- 10mA
- Sheet 5:  OSD62-PM Signals | 1.2V @ 2A
- Buck 3 
  1.2V @ 600mA
- 20mA
- Buck 3 | VDDS_DDR
- VDDS_DDR 
  (includes DDR4 VDD/VDDQ)
- 20mA | 1/3 | 1/0 | 1/0 | 1/0 | 30mA
- Sheet 6:  USB-C / CSI / Power In / Osc
- Buck 3
  (1.2 V)
- 1.8V / 3.3V @ 400mA
- LDO 1
  1.8V/3.3V @ 80mA
- 20mA | VDDS_DDR_C
- LDO 1 | VDDSHV5 (microSD) | 30mA
- Sheet 7:  Power Management | Total Core:  3100mA | 20mA
- USB-C
  DFP
  
  500mA
- Buck 2 Input
    - Required due to 
      power sequencing
- VDDR_CORE | 0/3 | 1/0 | 1/0
- 0.85V @ 400mA
- LDO 2 
  0.85V @ 80mA
- VDDR_CORE | 30mA
- LDO2
  (0.85 V)
- 30mA
- Sheet 8:  JTAG / Boot Mode / microSD / etc. | VIN-LDO2 | LDO 2 | VDDS_DDR_C
- VDDA_1P8_OLDI0 | 1/0 | 0/1 | 0/1
- 30mA
- Sheet 9:  IO Headers | 1.8V @ 300mA
- LDO 3 
  1.8V @ 200mA
- VDDS_OSC0 | VDDA_1P8_CSIRX0
- LDO 3 | VDDA_MCU | VDDA_1P8_OLDI0
- LDO3
  (1.8 V)
- VDDA_1P8_CSIRX0 | 1/0 | 0/1 | 0/1
- VDDA_PLLx | VDDA_1P8_USB | 5mA | 30mA
- Sheet 10:  LVDS Connector | VDDA_TEMPx | 40mA
- 2.5V @ 300mA
- LDO 4 
  2.5V @ 60mA
- VDDA_1V8_USB | 1/0 | 0/1
- GPO2 | LDO 4 | DDR_VPP | 30mA
- Sheet 11:  Blank | 400mA
- VDDA_1V8_MCU | 1/0
- 30mA
- Sheet 12:  Design Notes | 10mA | 50mA
- TPS22965 | VDDA_1V8_PLL0 | 1/0
- 30mA
- 3.3V
- EN | VDDA_3P3_USB | 250mA | 200mA | VDDA_1V8_PLL1 | 1/0
- Load Switch
  6A
- VDDA_1V8_PLL2 | 1/0
- OSD62-PM BRK | VDDSHV_CANUART
- VDDSHV_MCU
- VDDSHV0 | Internal PM / OSD62 BRK Board
- VDDSHV1
- VDDSHV2
- See Documents:  
    - https://www.ti.com/lit/an/sprac76f/sprac76f.pdf  (see page 29)
    - https://www.ti.com/lit/zip/spar001 (See Sheet 14)
- To
  System
- VDDSHV3 | 200mA
- VDDSHV4
- VDDSHV6
- USB-C Power Discussion
- Maximum Current Requirements:
    - https://www.ti.com/lit/an/sprada6/sprada6.pdf
- The USB-C UFP uses 5.1k pull down resistors on the CC pins to request up to 3A from the DFP.  However, this board does not check the voltage of the CC pins to understand the current provided by the DFP port.  The USB-C DFP port 
  on this board uses 56k ohm pull up resistors to advertise 500mA of current availlable.  It is the resposibility of the user to guarantee that there is enough current to support both the components on the board as welll as any downstream
  USB devices.
- Version 1D
- VPP LDO
- To program internal OTP memory (security keys, etc.), VPP must be 
  supplied by an externally controllable power supply.  
  
  Jumper J1 must be installed to program the OTP memory.
- I2C Table | Mechanical & Misc
- I2C0 | Fiducials
- ADDRESS | DEVICE
- 0x13 | TPS65219
- 0x50 | EEPROM
- 0x51 | ADC121C027
- 0x52 | ADC121C027
- 1/12 | 1D | 2/12 | 1D | 3/12 | 1D | 4/12 | 1D

## Library data of the parts
C1-C3 C6-C15 C17-C20 C61 = OSD62-PM-BRK:C: Capacitor SMD. Sizes: 0201, 0402, 0603, 0805 & 1206; SIZE: 0201; VOLTAGE: 6.3V
C4 C24 C26 C29 C34-C36 C46 C50 C54 C55 C58 C59 C62 C63 = OSD62-PM-BRK:C: Capacitor SMD. Sizes: 0201, 0402, 0603, 0805 & 1206; SIZE: 0402; VOLTAGE: 6.3V
C5 C16 C21-C23 C30 C38-C45 C48 C51 C52 C60 = OSD62-PM-BRK:C: Capacitor SMD. Sizes: 0201, 0402, 0603, 0805 & 1206; SIZE: 0402; VOLTAGE: 10V
C25 = OSD62-PM-BRK:CPOL-US: POLARIZED CAPACITOR, American symbol
C27 C31-C33 C37 C57 = OSD62-PM-BRK:C: Capacitor SMD. Sizes: 0201, 0402, 0603, 0805 & 1206; SIZE: 0603; VOLTAGE: 10V
C28 = OSD62-PM-BRK:C: Capacitor SMD. Sizes: 0201, 0402, 0603, 0805 & 1206; SIZE: 0402
C47 C49 C53 = OSD62-PM-BRK:C: Capacitor SMD. Sizes: 0201, 0402, 0603, 0805 & 1206; SIZE: 0603; VOLTAGE: 6.3V
C56 = OSD62-PM-BRK:C: Capacitor SMD. Sizes: 0201, 0402, 0603, 0805 & 1206; SIZE: 0805; VOLTAGE: 10V
D1-D5 = OSD62-PM-BRK:LTST-C191TBKT: PointLED® Enhanced Thinfilm LED TOP & BOTTOM mount EIA-STD, P47F
D6 D7 = OSD62-PM-BRK:RB520S30T1G
D8 = OSD62-PM-BRK:RBS2MM40C: Schottky Diode: 2A, 40V - Footprint also supports: SD1206S040L2R0
FUD1-FUD6 = OSD62-PM-BRK:FIDUCIAL
J1 J2 J7 = OSD62-PM-BRK:PINHD-1X2: 2-pin 100 mil header
J4 = OSD62-PM-BRK:1-1734248-5: CONN FPC VERT 15POS 1.00MM SMD Check availability <https://pricing.snapeda.com/parts/1-1734248-5/TE%20Connectivity/view-part?ref=eda>; AVAILABILITY: In Stock; CHECK_PRICES: https://www.snapeda.com/parts/1-1734248-5/TE+Connectivity+AMP+Connectors/view-part/?ref=eda; COMMENT: 1-1734248-5; DESCRIPTION: 15 Position FPC Connector Contacts, Vertical - 1 Sided 0.039 (1.00mm) Surface Mount; MF: TE Connectivity; MP: 1-1734248-5; PACKAGE: None; PRICE: None; PURCHASE-URL: https://www.snapeda.com/api/url_track_click_mouser/?unipart_id=618488&manufacturer=TE Connectivity&part_name=1-1734248-5&search_term=1-1734248-5; SNAPEDA_LINK: https://www.snapeda.com/parts/1-1734248-5/TE+Connectivity+AMP+Connectors/view-part/?ref=snap
J5 = OSD62-PM-BRK:USB4105-GF-A: Check availability <https://pricing.snapeda.com/parts/USB4105-GF-A/GCT/view-part?ref=eda>; AVAILABILITY: In Stock; CHECK_PRICES: https://www.snapeda.com/parts/USB4105-GF-A/Global+Connector+Technology/view-part/?ref=eda; DESCRIPTION: USB-C (USB TYPE-C) USB 2.0 Receptacle Connector 24 (16+8 Dummy) Position Surface Mount, Right Angle; Through Hole; MF: GCT; MP: USB4105-GF-A; PACKAGE: None; PRICE: None; PURCHASE-URL: https://www.snapeda.com/api/url_track_click_mouser/?unipart_id=4423780&manufacturer=GCT&part_name=USB4105-GF-A&search_term=usb4105-gf-a; SNAPEDA_LINK: https://www.snapeda.com/parts/USB4105-GF-A/Global+Connector+Technology/view-part/?ref=snap
J6 = OSD62-PM-BRK:2171820001: Check availability <https://pricing.snapeda.com/parts/217182-0001/Molex/view-part?ref=eda>; AVAILABILITY: In Stock; CHECK_PRICES: https://www.snapeda.com/parts/217182-0001/Molex/view-part/?ref=eda; DESCRIPTION: USB Type C - Connector, Vertical SMT L6.4 16pos | Molex Incorporated 217182-0001; MF: Molex; MP: 217182-0001; PACKAGE: None; PRICE: None; PURCHASE-URL: https://www.snapeda.com/api/url_track_click_mouser/?unipart_id=6306497&manufacturer=Molex&part_name=217182-0001&search_term=2171820001; SNAPEDA_LINK: https://www.snapeda.com/parts/217182-0001/Molex/view-part/?ref=snap
J8 = OSD62-PM-BRK:505110-4091: 40 Position FFC, FPC Connector Contacts, Bottom 0.020" (0.50mm) Surface Mount, Right Angle Check availability <https://pricing.snapeda.com/parts/5051104091/Molex/view-part?ref=eda>; AVAILABILITY: In Stock; DESCRIPTION: 40 Position FFC, FPC Connector Contacts, Bottom 0.020 (0.50mm) Surface Mount, Right Angle; MF: Molex; MP: 5051104091; PACKAGE: None; PRICE: None; PURCHASE-URL: https://pricing.snapeda.com/search/part/5051104091/?ref=eda
JP1 = OSD62-PM-BRK:PINHD-1X3: PIN HEADER
JP2-JP5 = OSD62-PM-BRK:PINHD-1X40: PIN HEADER
L1 L4 = OSD62-PM-BRK:L; CURRENT: 5.2A; SIZE: 0806
L2 L3 = OSD62-PM-BRK:L; CURRENT: 3A; SIZE: 0603
R1-R5 R7 R10-R34 R37-R74 R76 = OSD62-PM-BRK:R-US_: RESISTOR, American symbol; SIZE: 0402; TOLERANCE: 5%
R6 R8 R9 R35 R36 = OSD62-PM-BRK:R-US_: RESISTOR, American symbol; SIZE: 0402; TOLERANCE: 1%
S1 = OSD62-PM-BRK:TACT: Library: MF_Switches Description: Device for Tact Switches. Manufacture part number (MFG#) can be added via Attributes.; HOUSEPART: YES; MPN: MF-SW-TACT-4.2MM; POPULATE: 1; URL: https://factory.macrofab.com/part/MF-SW-TACT-4.2MM
TC1 = OSD62-PM-BRK:TC2050-IDC: Tag-Connect In Circuit Programming & Debug Cable 10 Pin http://www.tag-connect.com
TP1-TP3 TP6 TP7 = OSD62-PM-BRK:TP: Test pad
U1 = OSD62-PM-BRK:OSD6254-1G-IPM: OSD62x-SO BGA Array
U2 U9 = OSD62-PM-BRK:TPD4S012_DRY_6
U3 = OSD62-PM-BRK:TLV62595DMQR
U4 = OSD62-PM-BRK:24AA32A
U5 = OSD62-PM-BRK:TPS22965DSGT: 5.7-V, 6-A, 16-mΩ load switch with adj. rise time and optional output discharge Check availability <https://pricing.snapeda.com/parts/TPS22965DSGT/Texas%20Instruments/view-part?ref=eda>; AVAILABILITY: In Stock; CHECK_PRICES: https://www.snapeda.com/parts/TPS22965DSGT/Texas+Instruments/view-part/?ref=eda; DESCRIPTION: 5.7-V, 6-A, 16-mΩ load switch with adj. rise time and optional output discharge; MF: Texas Instruments; MP: TPS22965DSGT; PACKAGE: WSON-8 Texas Instruments; PRICE: None; PURCHASE-URL: https://www.snapeda.com/api/url_track_click_mouser/?unipart_id=208538&manufacturer=Texas Instruments&part_name=TPS22965DSGT&search_term=tps22965dsgt; SNAPEDA_LINK: https://www.snapeda.com/parts/TPS22965DSGT/Texas+Instruments/view-part/?ref=snap
U6 = OSD62-PM-BRK:TPS65219
U7 U8 = OSD62-PM-BRK:ADC121C027CIMK: Check availability <https://pricing.snapeda.com/parts/ADC121C027CIMK/NOPB/Texas%20Instruments/view-part?ref=eda>; AVAILABILITY: In Stock; DESCRIPTION: I2C-Compatible, 12-Bit Analog-to-Digital Converter with Alert Function 6-SOT-23-THIN -40 to 105; MF: Texas Instruments; MP: ADC121C027CIMK/NOPB; PACKAGE: SOT-23-THN-6 Texas Instruments; PRICE: None; PURCHASE-URL: https://pricing.snapeda.com/search/part/ADC121C027CIMK/NOPB/?ref=eda
U10 = OSD62-PM-BRK:TPS22918DBVR: Check availability <https://pricing.snapeda.com/parts/TPS22918DBVR/Texas%20Instruments/view-part?ref=eda>; AVAILABILITY: In Stock; CHECK_PRICES: https://www.snapeda.com/parts/TPS22918DBVR/Texas+Instruments/view-part/?ref=eda; DESCRIPTION: 5.5-V, 2-A, 52-mΩ load switch with adj. rise time and adj. output discharge; MF: Texas Instruments; MP: TPS22918DBVR; PACKAGE: SOT-23-6 Texas Instruments; PRICE: None; PURCHASE-URL: https://www.snapeda.com/api/url_track_click_mouser/?unipart_id=490084&manufacturer=Texas Instruments&part_name=TPS22918DBVR&search_term=tps22918dbvr; SNAPEDA_LINK: https://www.snapeda.com/parts/TPS22918DBVR/Texas+Instruments/view-part/?ref=snap
U11 = OSD62-PM-BRK:SN74LVC1G04DSFR: Check availability <https://pricing.snapeda.com/parts/SN74LVC1G04DSFR/Texas%20Instruments/view-part?ref=eda>; AVAILABILITY: In Stock; CHECK_PRICES: https://www.snapeda.com/parts/SN74LVC1G04DSFR/Texas+Instruments/view-part/?ref=eda; DESCRIPTION: Single 1.65-V to 5.5-V inverter; MF: Texas Instruments; MP: SN74LVC1G04DSFR; PACKAGE: X2SON-6 Texas Instruments; PRICE: None; SNAPEDA_LINK: https://www.snapeda.com/parts/SN74LVC1G04DSFR/Texas+Instruments/view-part/?ref=snap
U12 U13 = OSD62-PM-BRK:SN74LVC2G241YZPR
U14 = OSD62-PM-BRK:TLV75518P
X1 = OSD62-PM-BRK:SD_CARD_SLOT: Library: MF_Connectors Description: SD Card Connector; HOUSEPART: YES; MPN: MF-MICROSD; POPULATE: 1; URL: https://factory.macrofab.com/part/MF-MICROSD
Y1 = OSD62-PM-BRK:SIT1533AI-H4-D14-32.768
Y2 = OSD62-PM-BRK:SIT8008BI-73-YYS-25.000000